# EAGLE design senseBox-MCU_v10 (EAGLE 7.7.0)

## Sheet 1 of 4
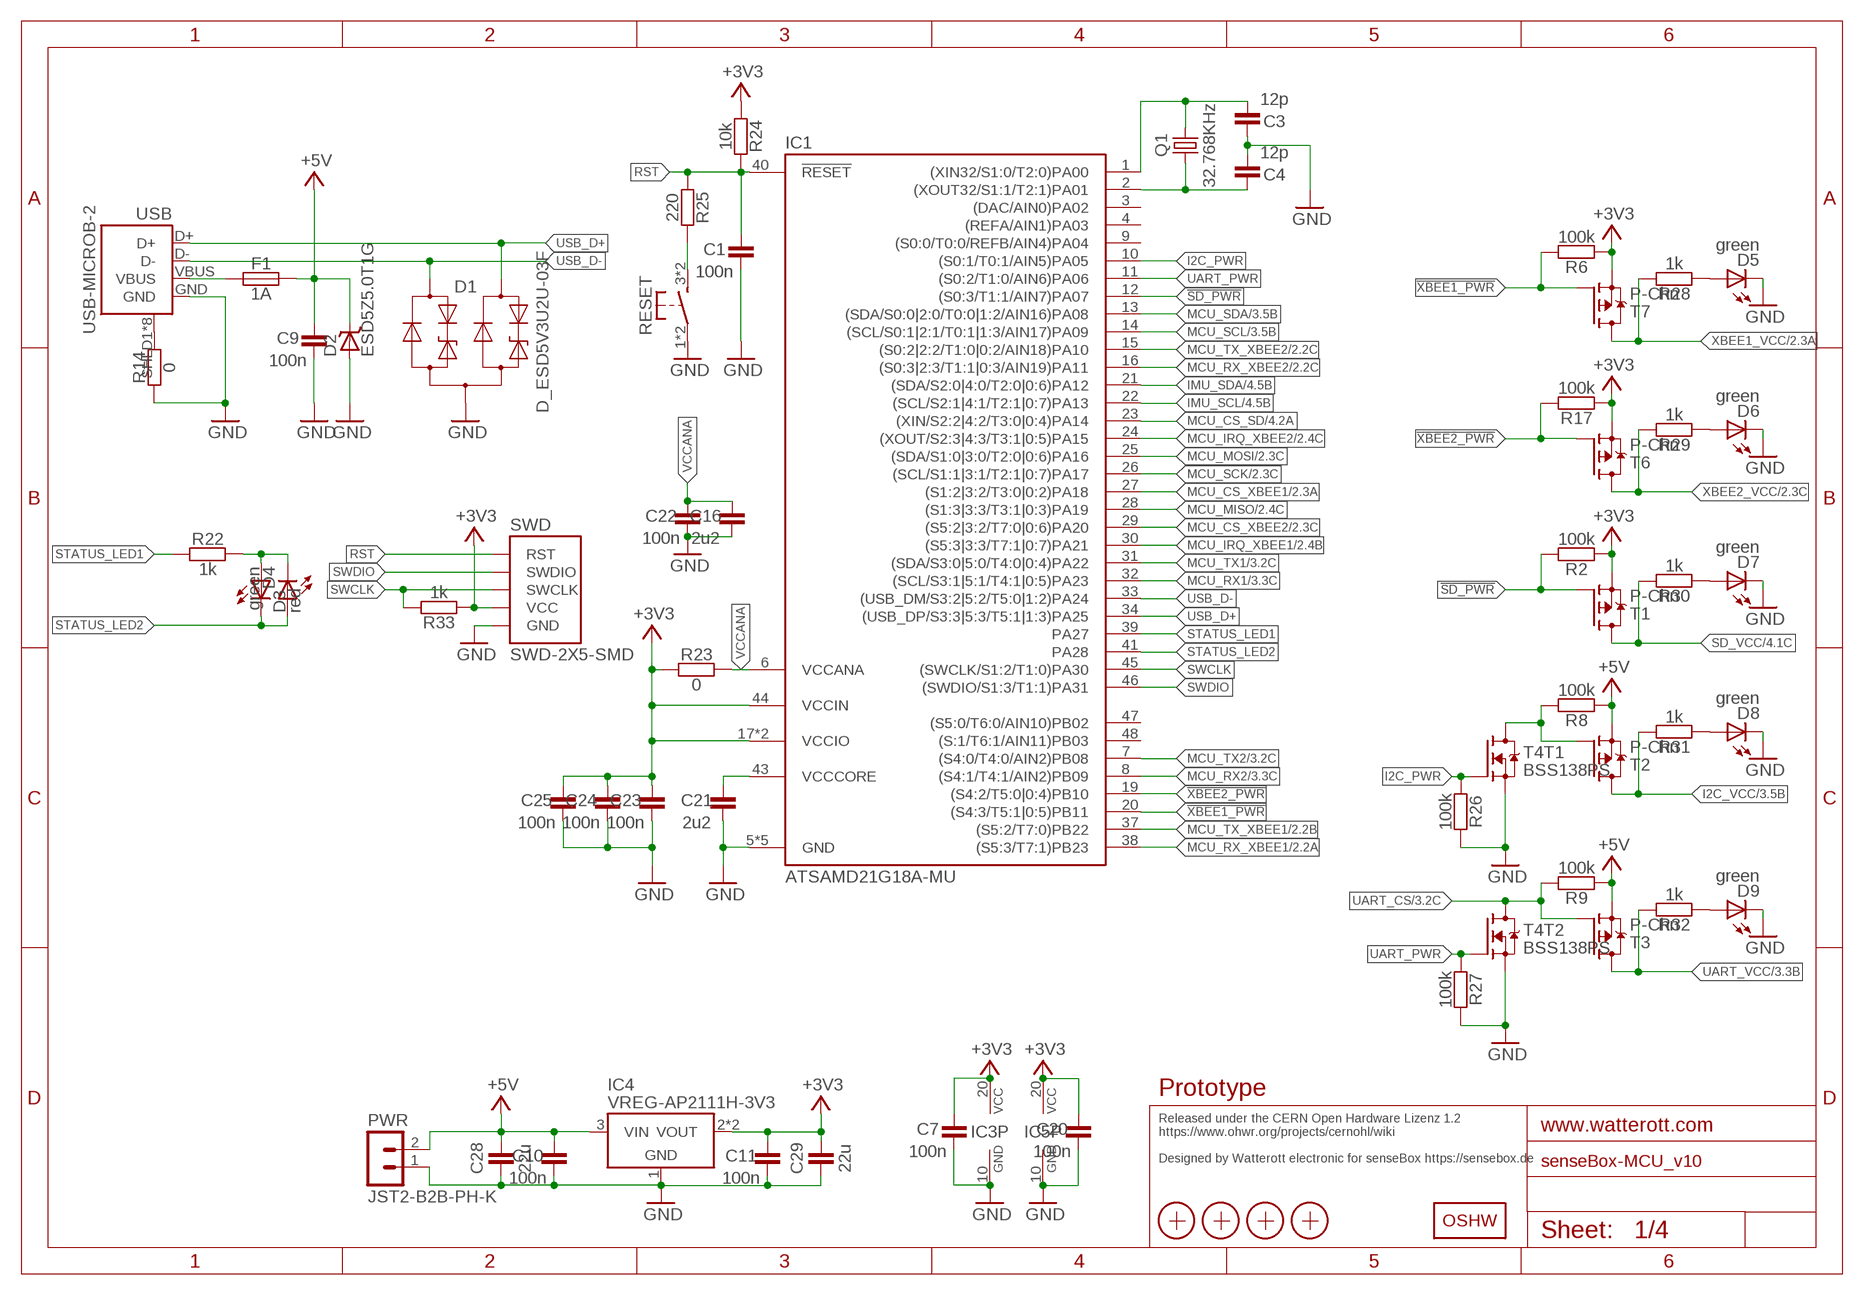
[diagram p0: schematic, sheet 1]

### Parts
C1  100n  CAPACITOR-0402  [C0402]
C3  12p  CAPACITOR-0402  [C0402]
C4  12p  CAPACITOR-0402  [C0402]
C7  100n  CAPACITOR-0402  [C0402]
C9  100n  CAPACITOR-0402  [C0402]
C10  100n  CAPACITOR-0402  [C0402]
C11  100n  CAPACITOR-0402  [C0402]
C16  2u2  CAPACITOR-0402  [C0402]
C20  100n  CAPACITOR-0402  [C0402]
C21  2u2  CAPACITOR-0402  [C0402]
C22  100n  CAPACITOR-0402  [C0402]
C23  100n  CAPACITOR-0402  [C0402]
C24  100n  CAPACITOR-0402  [C0402]
C25  100n  CAPACITOR-0402  [C0402]
C28  22u  CAPACITOR-0805  [C0805]
C29  22u  CAPACITOR-0805  [C0805]
D1  D_ESD5V3U2U-03F  [SOT723]
D2  ESD5Z5.0T1G  D_TVS-SOD523  [SOD523]
D3  red  LED-0603  [C0603]
D4  green  LED-0603  [C0603]
D5  green  LED-0603  [C0603]
D6  green  LED-0603  [C0603]
D7  green  LED-0603  [C0603]
D8  green  LED-0603  [C0603]
D9  green  LED-0603  [C0603]
F1  1A  FUSE-0805  [C0805]
IC1  ATSAMD21G18A-MU  [QFN48-PAD]
IC3  74LVC244PW  [TSSOP20]
IC4  VREG-AP2111H-3V3  VREG-TS1117CW-3V3  [SOT223]
IC5  74LVC244PW  [TSSOP20]
LOGO2  OSHW_LOGOX0070  [OSHW_6X70]
PWR  JST2-B2B-PH-K  [JST_B2B-PH-K]
Q1  32.768KHz  CRYSTAL-ZM315  [CRYSTAL_ZM315]
R2  100k  RESISTOR-0402  [C0402]
R6  100k  RESISTOR-0402  [C0402]
R8  100k  RESISTOR-0402  [C0402]
R9  100k  RESISTOR-0402  [C0402]
R14  0  RESISTOR-0402  [C0402]
R17  100k  RESISTOR-0402  [C0402]
R22  1k  RESISTOR-0402  [C0402]
R23  0  RESISTOR-0402  [C0402]
R24  10k  RESISTOR-0402  [C0402]
R25  220  RESISTOR-0402  [C0402]
R26  100k  RESISTOR-0402  [C0402]
R27  100k  RESISTOR-0402  [C0402]
R28  1k  RESISTOR-0402  [C0402]
R29  1k  RESISTOR-0402  [C0402]
R30  1k  RESISTOR-0402  [C0402]
R31  1k  RESISTOR-0402  [C0402]
R32  1k  RESISTOR-0402  [C0402]
R33  1k  RESISTOR-0402  [C0402]
RESET  SW-TACTILE-PTS840P  [PTS840P]
SWD  SWD-2X5-SMD  [SWD-2X5_SMD]
T1  P-Chn  MOSFET-P-SOT23  [SOT23]
T2  P-Chn  MOSFET-P-SOT23  [SOT23]
T3  P-Chn  MOSFET-P-SOT23  [SOT23]
T4  BSS138PS  [SOT363]
T6  P-Chn  MOSFET-P-SOT23  [SOT23]
T7  P-Chn  MOSFET-P-SOT23  [SOT23]
USB  USB-MICROB-2  [USB-MICROB-10118194]
X1  PASSER-07  [PASSER_07MM]
X2  PASSER-07  [PASSER_07MM]
X3  PASSER-07  [PASSER_07MM]
X4  PASSER-07  [PASSER_07MM]

### Nets
!I2C_POWER: R8.2 T2.1(G) T4.6(T1:D)
!SD_PWR: IC1.12((S0:3/T1:1/AIN7)PA07) R2.2 T1.1(G)
!XBEE1_PWR: IC1.20((S4:3/T5:1|0:5)PB11) R6.2 T7.1(G)
!XBEE2_PWR: IC1.19((S4:2/T5:0|0:4)PB10) R17.2 T6.1(G)
+3V3: C7.2 C11.2 C20.2 C23.2 C24.2 C25.2 C29.2 IC1.17(VCCIO) IC1.36(VCCIO) IC1.44(VCCIN) IC3.20(P:VCC) IC4.2(VOUT) IC4.4(VOUT) IC5.20(P:VCC) R2.1 R6.1 R17.1 R23.1 R24.1 R33.1 SWD.VCC T1.2(S) T6.2(S) T7.2(S) ; also sheet 3,4
+5V: C9.2 C10.2 C28.2 D2.C F1.2 IC4.3(VIN) PWR.2 R8.1 R9.1 T2.2(S) T3.2(S)
GND: C1.1 C3.2 C4.1 C7.1 C9.1 C10.1 C11.1 C16.1 C20.1 C21.1 C22.1 C23.1 C24.1 C25.1 C28.1 C29.1 D1.3(A) D2.A D5.C D6.C D7.C D8.C D9.C IC1.5(GND) IC1.18(GND) IC1.35(GND) IC1.42(GND) IC1.TP(GND) IC3.10(P:GND) IC4.1(GND) IC5.10(P:GND) PWR.1 R14.1 R26.2 R27.2 RESET.1 RESET.2(P1) SWD.GND@1(GND) SWD.GND@2(GND) SWD.GND@3(GND) T4.1(T1:S) T4.4(T2:S) USB.GND ; also sheet 2,3,4
I2C_PWR: IC1.10((S0:1/T0:1/AIN5)PA05) R26.1 T4.2(T1:G)
I2C_VCC: R31.2 T2.3(D) ; also sheet 3
IMU_SCL: IC1.22((SCL/S2:1|4:1/T2:1|0:7)PA13) ; also sheet 4
IMU_SDA: IC1.21((SDA/S2:0|4:0/T2:0|0:6)PA12) ; also sheet 4
MCU_CS_SD: IC1.23((XIN/S2:2|4:2/T3:0|0:4)PA14) ; also sheet 4
MCU_CS_XBEE1: IC1.27((S1:2|3:2/T3:0|0:2)PA18) ; also sheet 2
MCU_CS_XBEE2: IC1.29((S5:2|3:2/T7:0|0:6)PA20) ; also sheet 2
MCU_IRQ_XBEE1: IC1.30((S5:3|3:3/T7:1|0:7)PA21) ; also sheet 2
MCU_IRQ_XBEE2: IC1.24((XOUT/S2:3|4:3/T3:1|0:5)PA15) ; also sheet 2
MCU_MISO: IC1.28((S1:3|3:3/T3:1|0:3)PA19) ; also sheet 2,4
MCU_MOSI: IC1.25((SDA/S1:0|3:0/T2:0|0:6)PA16) ; also sheet 2,4
MCU_RX1: IC1.32((SCL/S3:1|5:1/T4:1|0:5)PA23) ; also sheet 3
MCU_RX2: IC1.8((S4:1/T4:1/AIN2)PB09) ; also sheet 3
MCU_RX_XBEE1: IC1.38((S5:3/T7:1)PB23) ; also sheet 2
MCU_RX_XBEE2: IC1.16((S0:3|2:3/T1:1|0:3/AIN19)PA11) ; also sheet 2
MCU_SCK: IC1.26((SCL/S1:1|3:1/T2:1|0:7)PA17) ; also sheet 2,4
MCU_SCL: IC1.14((SCL/S0:1|2:1/T0:1|1:3/AIN17)PA09) ; also sheet 3
MCU_SDA: IC1.13((SDA/S0:0|2:0/T0:0|1:2/AIN16)PA08) ; also sheet 3
MCU_TX1: IC1.31((SDA/S3:0|5:0/T4:0|0:4)PA22) ; also sheet 3
MCU_TX2: IC1.7((S4:0/T4:0/AIN2)PB08) ; also sheet 3
MCU_TX_XBEE1: IC1.37((S5:2/T7:0)PB22) ; also sheet 2
MCU_TX_XBEE2: IC1.15((S0:2|2:2/T1:0|0:2/AIN18)PA10) ; also sheet 2
N$1: C3.1 IC1.1((XIN32/S1:0/T2:0)PA00) Q1.2
N$2: C4.2 IC1.2((XOUT32/S1:1/T2:1)PA01) Q1.1
N$5: D5.A R28.1
N$6: D6.A R29.1
N$7: D7.A R30.1
N$8: D8.A R31.1
N$9: D9.A R32.1
N$12: D3.A D4.C R22.2
N$13: R25.2 RESET.3(S1) RESET.4(S1)
RST: C1.2 IC1.40(!RESET) R24.2 R25.1 SWD.RST
SD_VCC: R30.2 T1.3(D) ; also sheet 4
SHLD: R14.2 USB.SHLD1(SHIELD) USB.SHLD2(SHIELD) USB.SHLD3(SHIELD) USB.SHLD4(SHIELD) USB.SHLD5(SHIELD) USB.SHLD6(SHIELD) USB.SHLD7(SHIELD) USB.SHLD8(SHIELD)
STATUS_LED1: IC1.39(PA27) R22.1
STATUS_LED2: D3.C D4.A IC1.41(PA28)
SWCLK: IC1.45((SWCLK/S1:2/T1:0)PA30) R33.2 SWD.SWCLK
SWDIO: IC1.46((SWDIO/S1:3/T1:1)PA31) SWD.SWDIO
UART_CS: R9.2 T3.1(G) T4.3(T2:D) ; also sheet 3
UART_PWR: IC1.11((S0:2/T1:0/AIN6)PA06) R27.1 T4.5(T2:G)
UART_VCC: R32.2 T3.3(D) ; also sheet 3
USB_D+: D1.2(C2) IC1.34((USB_DP/S3:3|5:3/T5:1|1:3)PA25) USB.D+
USB_D-: D1.1(C1) IC1.33((USB_DM/S3:2|5:2/T5:0|1:2)PA24) USB.D-
VBUS: F1.1 USB.VBUS
VCCANA: C16.2 C22.2 IC1.6(VCCANA) R23.2
VCCCORE: C21.2 IC1.43(VCCCORE)
XBEE1_VCC: R28.2 T7.3(D) ; also sheet 2
XBEE2_VCC: R29.2 T6.3(D) ; also sheet 2
Unconnected: IC1.3((DAC/AIN0)PA02) IC1.4((REFA/AIN1)PA03) IC1.9((S0:0/T0:0/REFB/AIN4)PA04) IC1.47((S5:0/T6:0/AIN10)PB02) IC1.48((S:1/T6:1/AIN11)PB03)

### Notes on the sheet
- Prototype
- Released under the CERN Open Hardware Lizenz 1.2
  https://www.ohwr.org/projects/cernohl/wiki
  
  Designed by Watterott electronic for senseBox https://sensebox.de

## Sheet 2 of 4
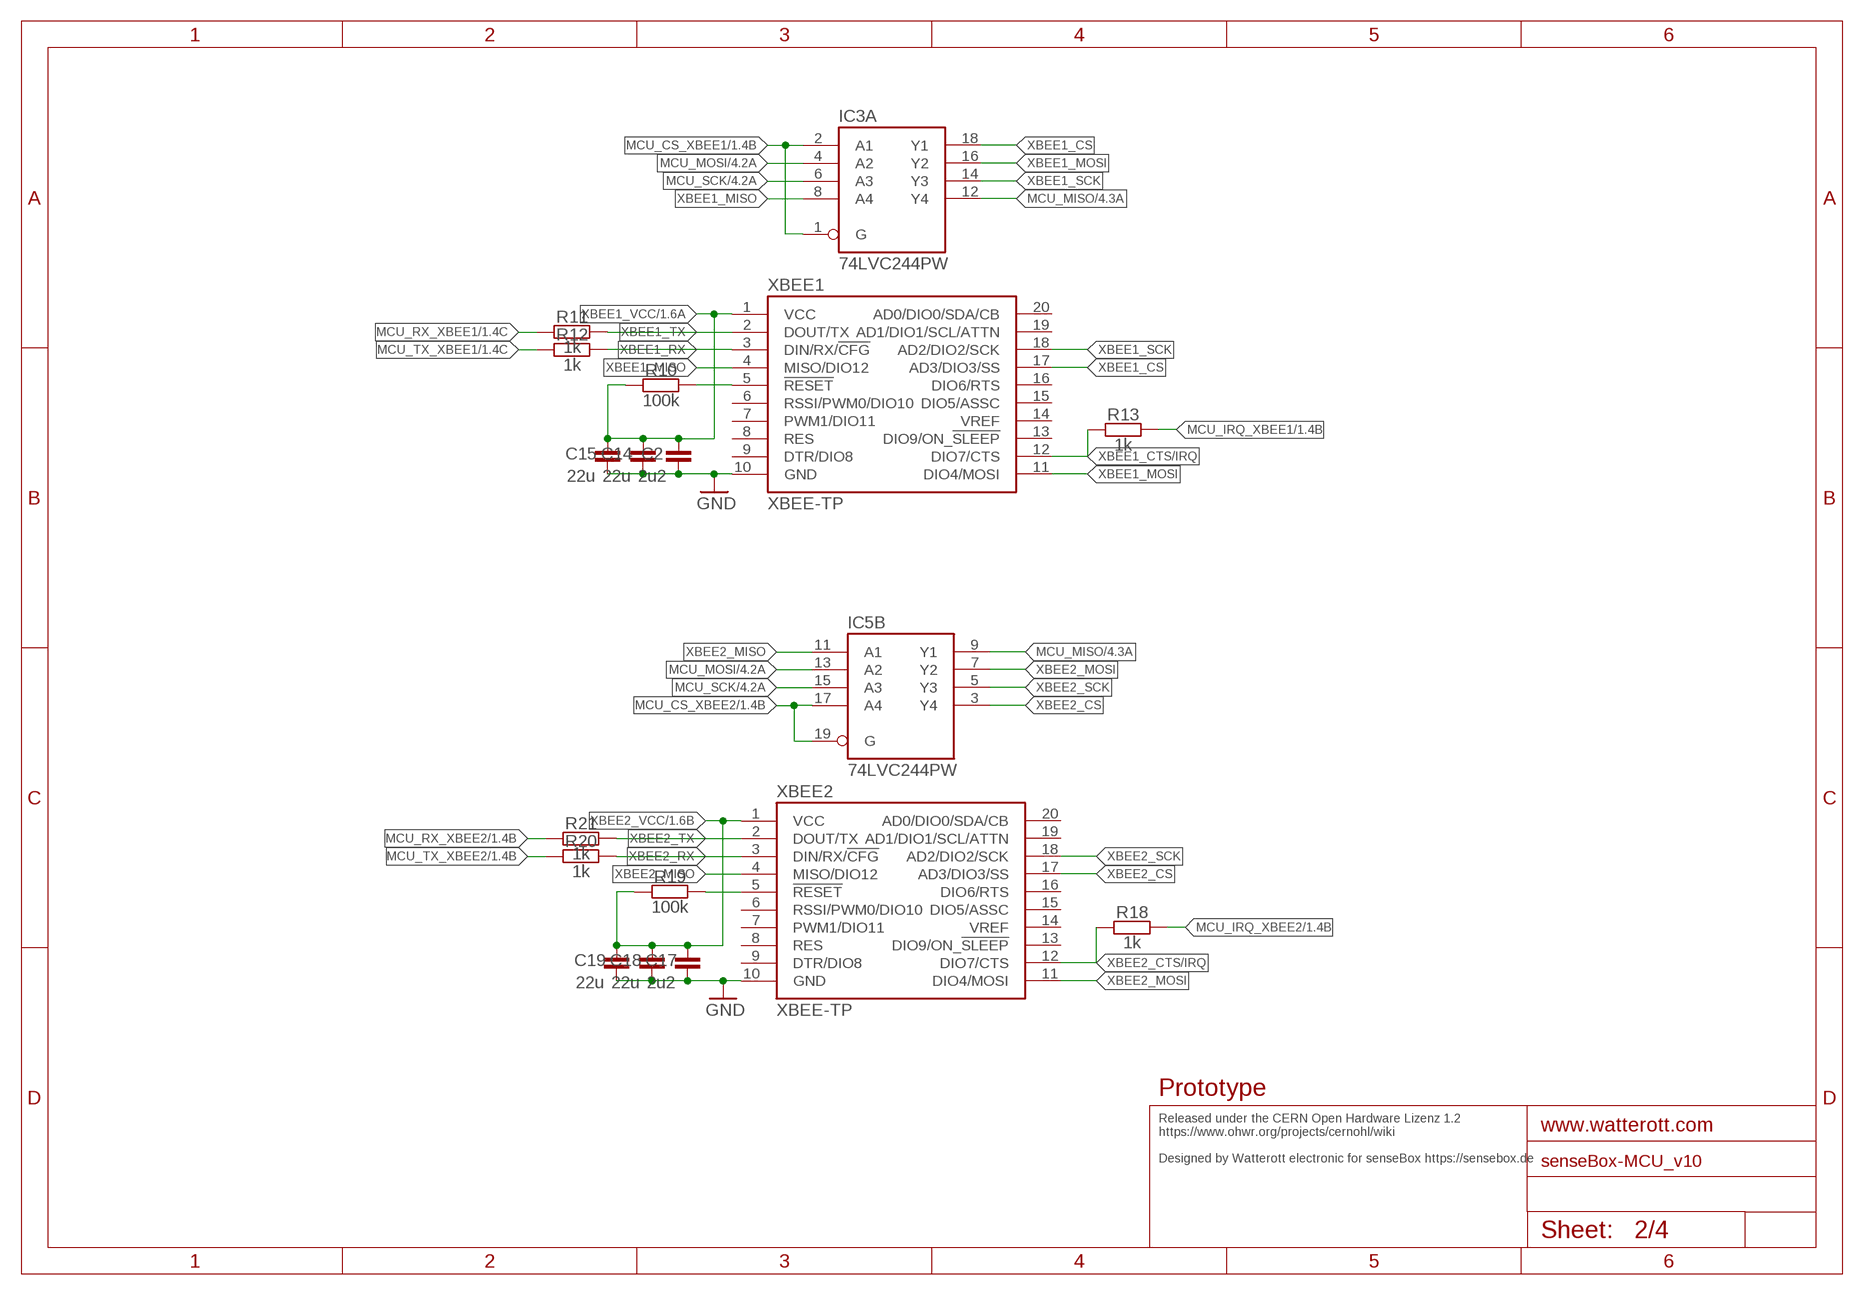
[diagram p1: schematic, sheet 2]

### Parts
C2  2u2  CAPACITOR-0402  [C0402]
C14  22u  CAPACITOR-0805  [C0805]
C15  22u  CAPACITOR-0805  [C0805]
C17  2u2  CAPACITOR-0402  [C0402]
C18  22u  CAPACITOR-0805  [C0805]
C19  22u  CAPACITOR-0805  [C0805]
R10  100k  RESISTOR-0402  [C0402]
R11  1k  RESISTOR-0402  [C0402]
R12  1k  RESISTOR-0402  [C0402]
R13  1k  RESISTOR-0402  [C0402]
R18  1k  RESISTOR-0402  [C0402]
R19  100k  RESISTOR-0402  [C0402]
R20  1k  RESISTOR-0402  [C0402]
R21  1k  RESISTOR-0402  [C0402]
XBEE1  XBEE-TP  [XBEE_TP]
XBEE2  XBEE-TP  [XBEE_TP]

### Nets
GND: C2.1 C14.1 C15.1 C17.1 C18.1 C19.1 XBEE1.10(GND) XBEE2.10(GND) ; also sheet 1,3,4
MCU_CS_XBEE1: IC3.1(A:G) IC3.2(A:A1) ; also sheet 1
MCU_CS_XBEE2: IC5.17(B:A4) IC5.19(B:G) ; also sheet 1
MCU_IRQ_XBEE1: R13.2 ; also sheet 1
MCU_IRQ_XBEE2: R18.2 ; also sheet 1
MCU_MISO: IC3.12(A:Y4) IC5.9(B:Y1) ; also sheet 1,4
MCU_MOSI: IC3.4(A:A2) IC5.13(B:A2) ; also sheet 1,4
MCU_RX_XBEE1: R11.1 ; also sheet 1
MCU_RX_XBEE2: R21.1 ; also sheet 1
MCU_SCK: IC3.6(A:A3) IC5.15(B:A3) ; also sheet 1,4
MCU_TX_XBEE1: R12.1 ; also sheet 1
MCU_TX_XBEE2: R20.1 ; also sheet 1
N$3: R19.2 XBEE2.5(!RESET!)
N$4: R10.2 XBEE1.5(!RESET!)
XBEE1_CS: IC3.18(A:Y1) XBEE1.17(AD3/DIO3/SS)
XBEE1_CTS/IRQ: R13.1 XBEE1.12(DIO7/CTS)
XBEE1_MISO: IC3.8(A:A4) XBEE1.4(MISO/DIO12)
XBEE1_MOSI: IC3.16(A:Y2) XBEE1.11(DIO4/MOSI)
XBEE1_RX: R12.2 XBEE1.3(DIN/RX/!CFG!)
XBEE1_SCK: IC3.14(A:Y3) XBEE1.18(AD2/DIO2/SCK)
XBEE1_TX: R11.2 XBEE1.2(DOUT/TX)
XBEE1_VCC: C2.2 C14.2 C15.2 R10.1 XBEE1.1(VCC) ; also sheet 1
XBEE2_CS: IC5.3(B:Y4) XBEE2.17(AD3/DIO3/SS)
XBEE2_CTS/IRQ: R18.1 XBEE2.12(DIO7/CTS)
XBEE2_MISO: IC5.11(B:A1) XBEE2.4(MISO/DIO12)
XBEE2_MOSI: IC5.7(B:Y2) XBEE2.11(DIO4/MOSI)
XBEE2_RX: R20.2 XBEE2.3(DIN/RX/!CFG!)
XBEE2_SCK: IC5.5(B:Y3) XBEE2.18(AD2/DIO2/SCK)
XBEE2_TX: R21.2 XBEE2.2(DOUT/TX)
XBEE2_VCC: C17.2 C18.2 C19.2 R19.1 XBEE2.1(VCC) ; also sheet 1
Unconnected: XBEE1.6(RSSI/PWM0/DIO10) XBEE1.7(PWM1/DIO11) XBEE1.8(RES) XBEE1.9(DTR/DIO8) XBEE1.13(DIO9/ON_!SLEEP!) XBEE1.14(VREF) XBEE1.15(DIO5/ASSC) XBEE1.16(DIO6/RTS) XBEE1.19(AD1/DIO1/SCL/ATTN) XBEE1.20(AD0/DIO0/SDA/CB) XBEE2.6(RSSI/PWM0/DIO10) XBEE2.7(PWM1/DIO11) XBEE2.8(RES) XBEE2.9(DTR/DIO8) XBEE2.13(DIO9/ON_!SLEEP!) XBEE2.14(VREF) XBEE2.15(DIO5/ASSC) XBEE2.16(DIO6/RTS) XBEE2.19(AD1/DIO1/SCL/ATTN) XBEE2.20(AD0/DIO0/SDA/CB)

### Notes on the sheet
- Prototype
- Released under the CERN Open Hardware Lizenz 1.2
  https://www.ohwr.org/projects/cernohl/wiki
  
  Designed by Watterott electronic for senseBox https://sensebox.de

## Sheet 3 of 4
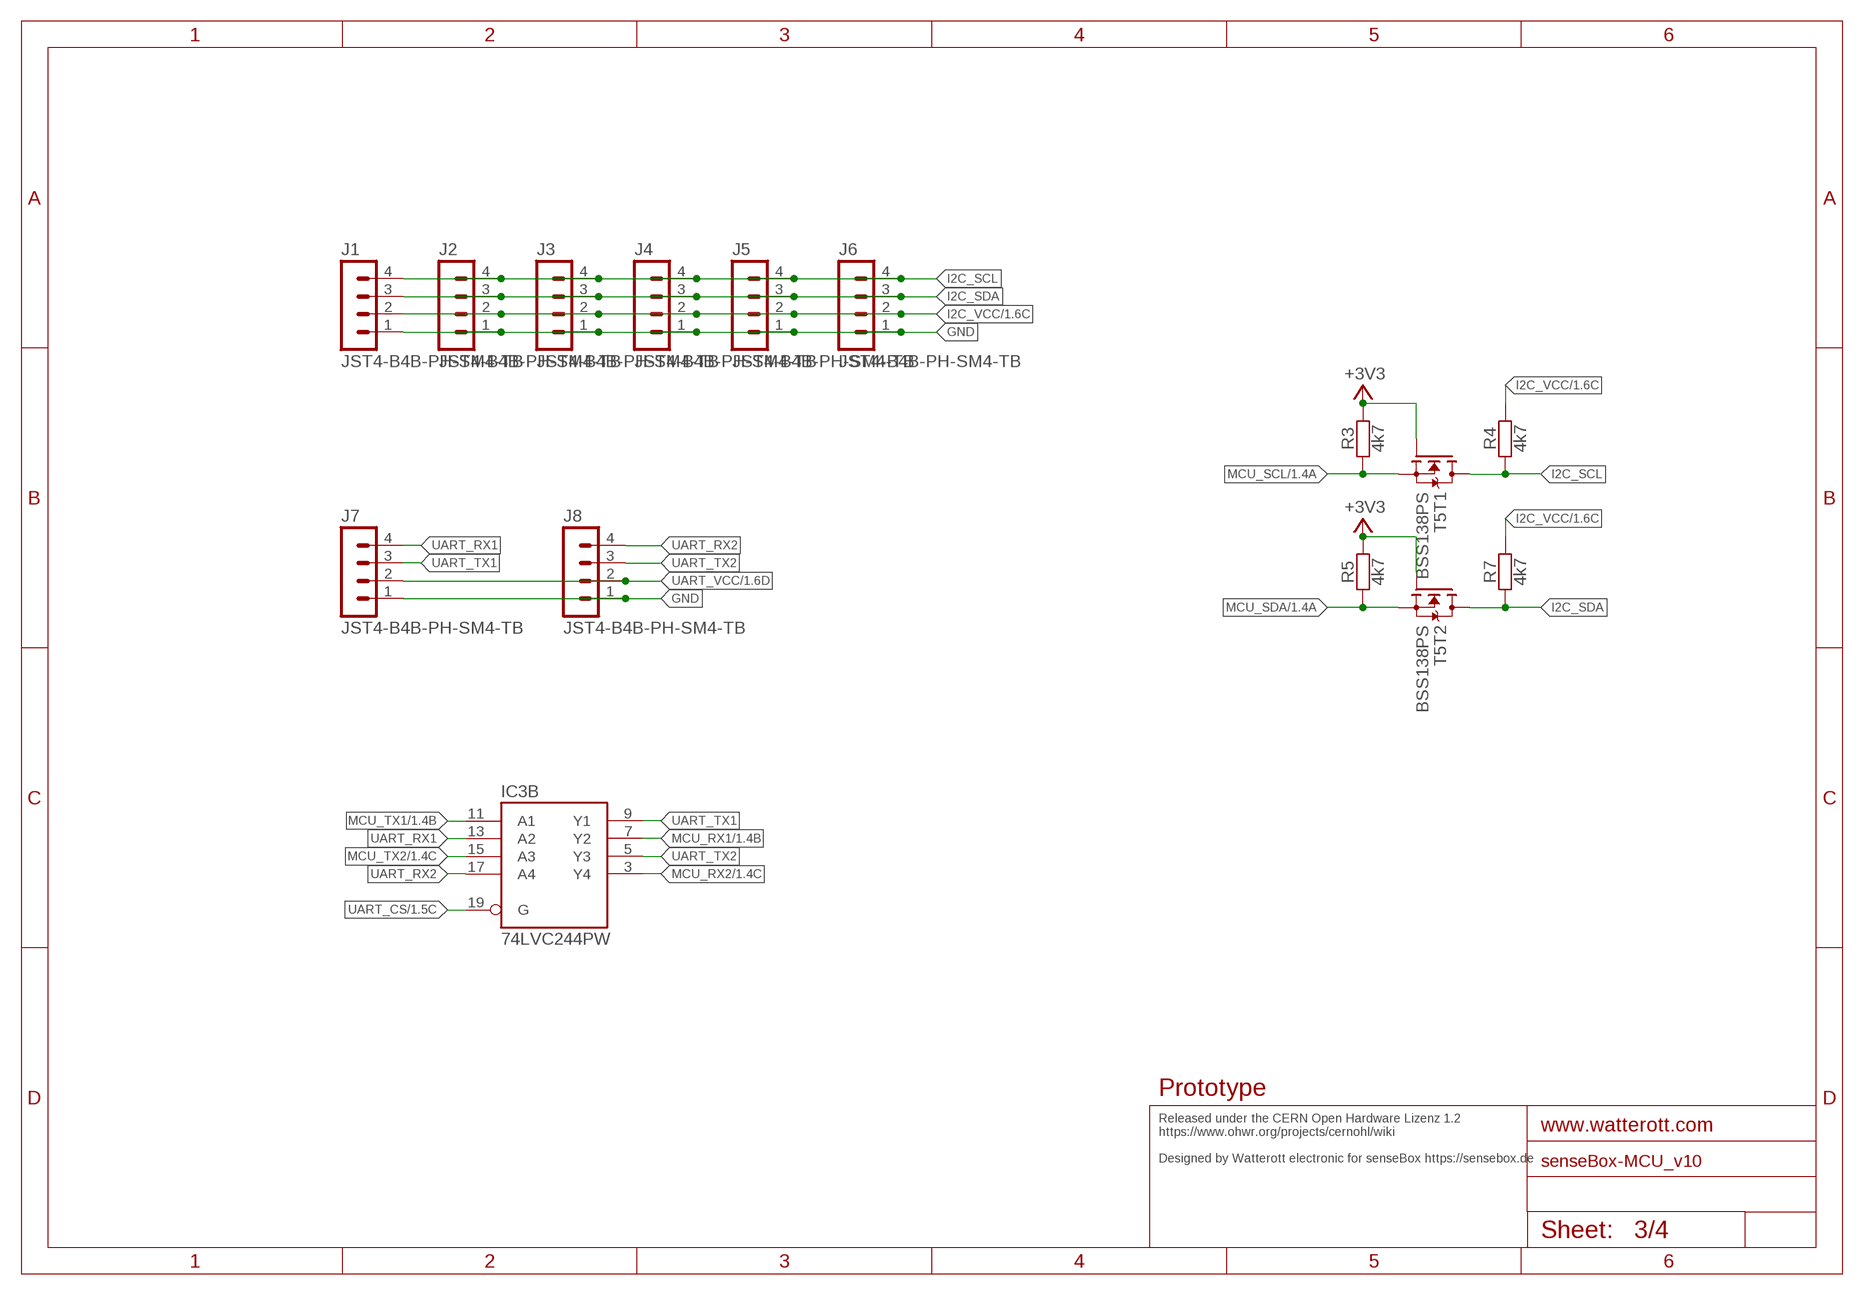
[diagram p2: schematic, sheet 3]

### Parts
J1  JST4-B4B-PH-SM4-TB  [JST_B4B-PH-SM4-TB]
J2  JST4-B4B-PH-SM4-TB  [JST_B4B-PH-SM4-TB]
J3  JST4-B4B-PH-SM4-TB  [JST_B4B-PH-SM4-TB]
J4  JST4-B4B-PH-SM4-TB  [JST_B4B-PH-SM4-TB]
J5  JST4-B4B-PH-SM4-TB  [JST_B4B-PH-SM4-TB]
J6  JST4-B4B-PH-SM4-TB  [JST_B4B-PH-SM4-TB]
J7  JST4-B4B-PH-SM4-TB  [JST_B4B-PH-SM4-TB]
J8  JST4-B4B-PH-SM4-TB  [JST_B4B-PH-SM4-TB]
R3  4k7  RESISTOR-0402  [C0402]
R4  4k7  RESISTOR-0402  [C0402]
R5  4k7  RESISTOR-0402  [C0402]
R7  4k7  RESISTOR-0402  [C0402]
T5  BSS138PS  [SOT363]

### Nets
+3V3: R3.2 R5.2 T5.2(T1:G) T5.5(T2:G) ; also sheet 1,4
GND: J1.1 J2.1 J3.1 J4.1 J5.1 J6.1 J7.1 J8.1 ; also sheet 1,2,4
I2C_SCL: J1.4 J2.4 J3.4 J4.4 J5.4 J6.4 R4.1 T5.6(T1:D)
I2C_SDA: J1.3 J2.3 J3.3 J4.3 J5.3 J6.3 R7.1 T5.3(T2:D)
I2C_VCC: J1.2 J2.2 J3.2 J4.2 J5.2 J6.2 R4.2 R7.2 ; also sheet 1
MCU_RX1: IC3.7(B:Y2) ; also sheet 1
MCU_RX2: IC3.3(B:Y4) ; also sheet 1
MCU_SCL: R3.1 T5.1(T1:S) ; also sheet 1
MCU_SDA: R5.1 T5.4(T2:S) ; also sheet 1
MCU_TX1: IC3.11(B:A1) ; also sheet 1
MCU_TX2: IC3.15(B:A3) ; also sheet 1
UART_CS: IC3.19(B:G) ; also sheet 1
UART_RX1: IC3.13(B:A2) J7.4
UART_RX2: IC3.17(B:A4) J8.4
UART_TX1: IC3.9(B:Y1) J7.3
UART_TX2: IC3.5(B:Y3) J8.3
UART_VCC: J7.2 J8.2 ; also sheet 1

### Notes on the sheet
- Prototype
- Released under the CERN Open Hardware Lizenz 1.2
  https://www.ohwr.org/projects/cernohl/wiki
  
  Designed by Watterott electronic for senseBox https://sensebox.de

## Sheet 4 of 4
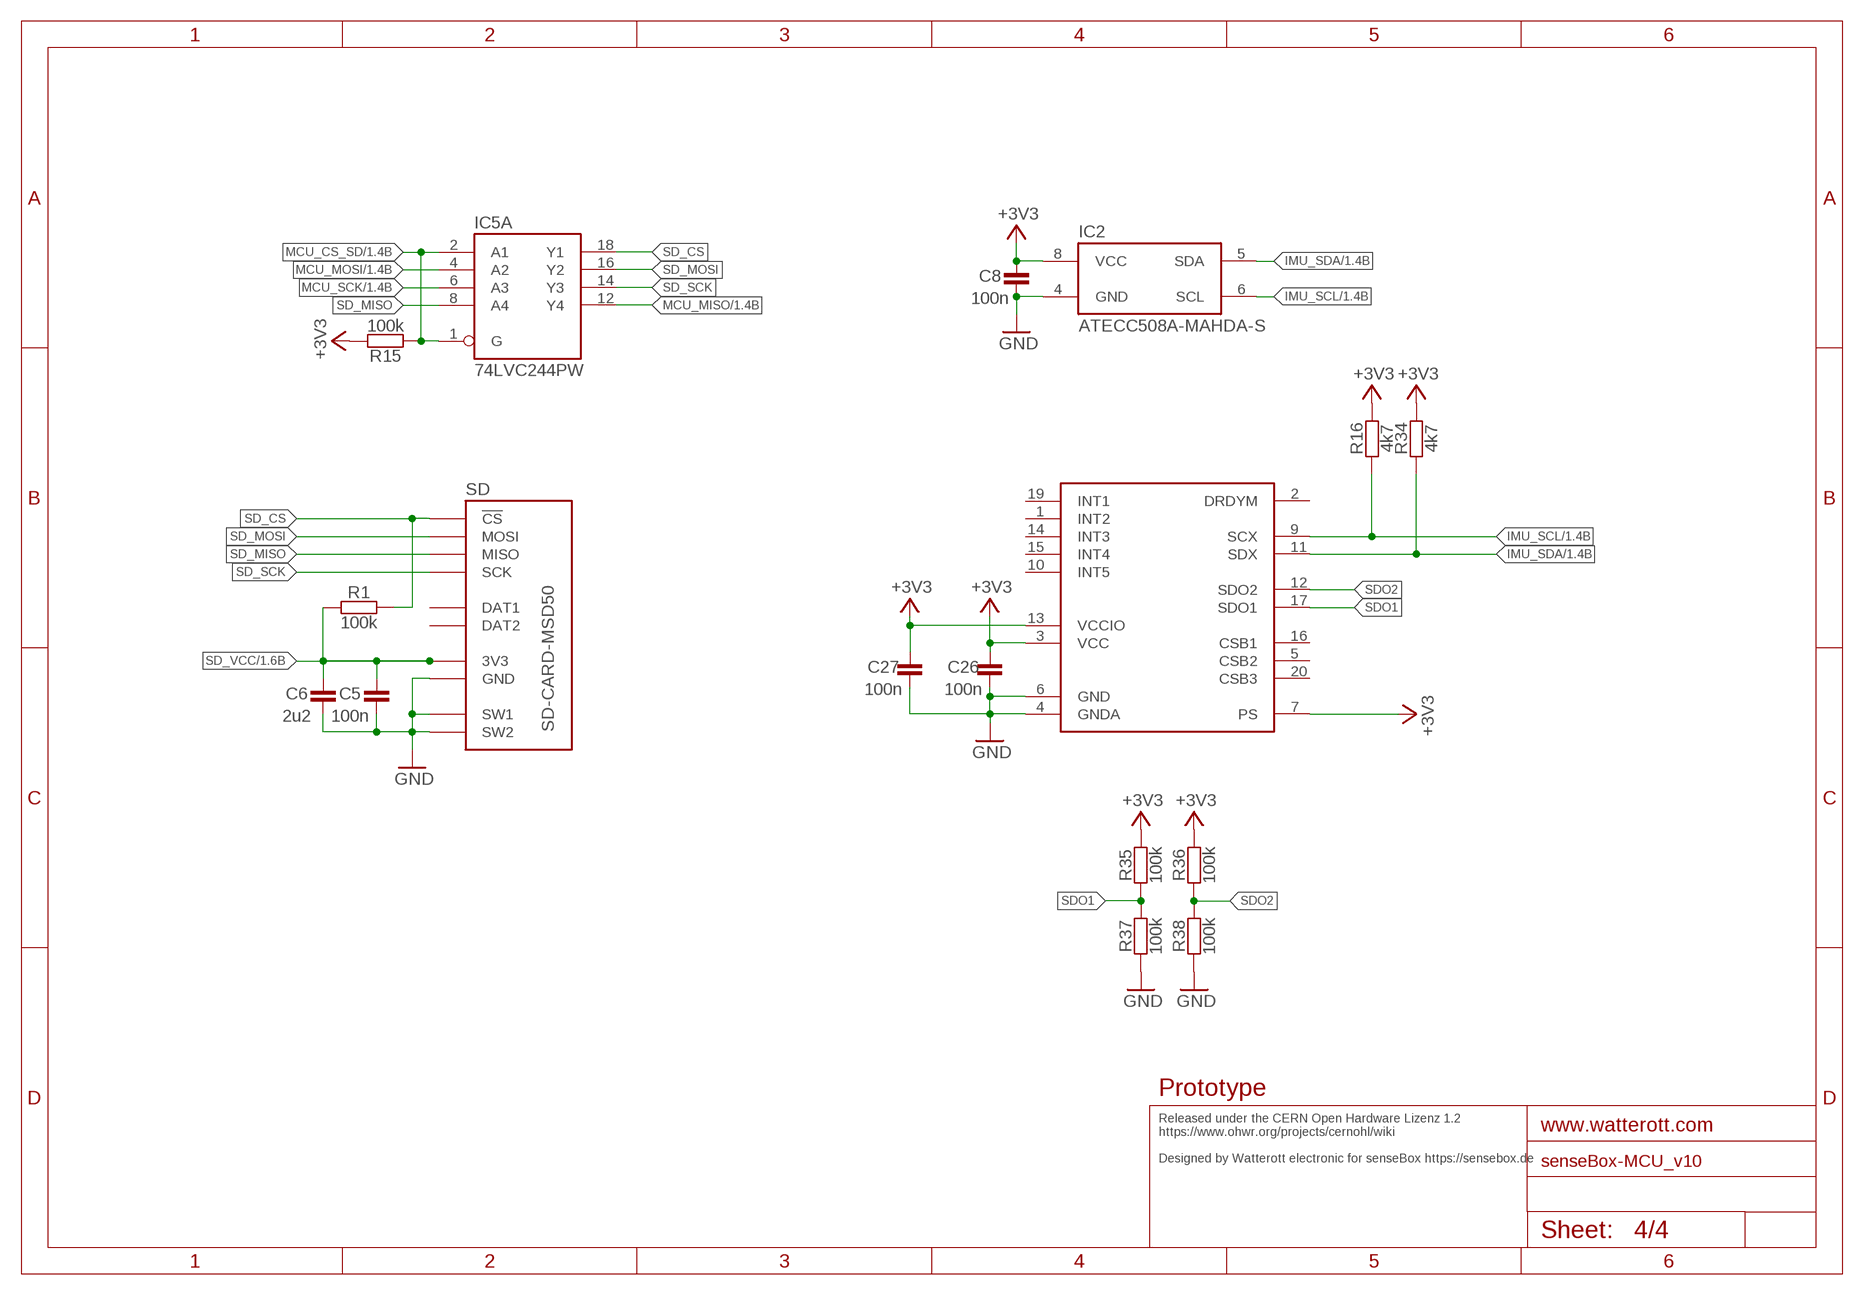
[diagram p3: schematic, sheet 4]

### Parts
C5  100n  CAPACITOR-0402  [C0402]
C6  2u2  CAPACITOR-0402  [C0402]
C8  100n  CAPACITOR-0402  [C0402]
C26  100n  CAPACITOR-0402  [C0402]
C27  100n  CAPACITOR-0402  [C0402]
IC2  ATECC508A-MAHDA-S  [UDFN8]
R1  100k  RESISTOR-0402  [C0402]
R15  100k  RESISTOR-0402  [C0402]
R16  4k7  RESISTOR-0402  [C0402]
R34  4k7  RESISTOR-0402  [C0402]
R35  100k  RESISTOR-0402  [C0402]
R36  100k  RESISTOR-0402  [C0402]
R37  100k  RESISTOR-0402  [C0402]
R38  100k  RESISTOR-0402  [C0402]
SD  SD-CARD-MSD50  [SD_5031821853]
U1  BMX055  [BMX055]

### Nets
+3V3: C8.2 C26.2 C27.2 IC2.8(VCC) R15.2 R16.2 R34.2 R35.2 R36.2 U1.3(VCC) U1.7(PS) U1.13(VCCIO) ; also sheet 1,3
GND: C5.1 C6.1 C8.1 C26.1 C27.1 IC2.4(GND) R37.1 R38.1 SD.GND SD.SW1 SD.SW2 U1.4(GNDA) U1.6(GND) ; also sheet 1,2,3
IMU_SCL: IC2.6(SCL) R16.1 U1.9(SCX) ; also sheet 1
IMU_SDA: IC2.5(SDA) R34.1 U1.11(SDX) ; also sheet 1
MCU_CS_SD: IC5.1(A:G) IC5.2(A:A1) R15.1 ; also sheet 1
MCU_MISO: IC5.12(A:Y4) ; also sheet 1,2
MCU_MOSI: IC5.4(A:A2) ; also sheet 1,2
MCU_SCK: IC5.6(A:A3) ; also sheet 1,2
SD_CS: IC5.18(A:Y1) R1.2 SD.CS(!CS)
SD_MISO: IC5.8(A:A4) SD.MISO
SD_MOSI: IC5.16(A:Y2) SD.MOSI
SD_SCK: IC5.14(A:Y3) SD.SCK
SD_VCC: C5.2 C6.2 R1.1 SD.VCC(3V3) ; also sheet 1
SDO1: R35.1 R37.2 U1.17(SDO1)
SDO2: R36.1 R38.2 U1.12(SDO2)
Unconnected: SD.DAT1 SD.DAT2 U1.1(INT2) U1.2(DRDYM) U1.5(CSB2) U1.10(INT5) U1.14(INT3) U1.15(INT4) U1.16(CSB1) U1.19(INT1) U1.20(CSB3)

### Notes on the sheet
- Prototype
- Released under the CERN Open Hardware Lizenz 1.2
  https://www.ohwr.org/projects/cernohl/wiki
  
  Designed by Watterott electronic for senseBox https://sensebox.de

## Library data of the parts
C1-C11 C14-C29 = we-rcl:CAPACITOR: Capacitors ...2.2uF @ 6.3V -> 0402 ...4.7uF @ 6.3V -> 0603 ...10uF @ 16V -> 0805 ...22uF @ 25V -> 1206
D1 = we-rcl:D_ESD5V3U2U: TVS Diode - Uni-directional Ultra Low ESD / Transient Protection Diode Vrwm=5.3V, 0.4pF@1MHz; DIGIKEY: ESD5V3U2U-03F H6327DKR-ND
D2 = we-rcl:D_TVS: TVS Diodes (Transient Voltage Suppressor Diodes)
D3-D9 = we-opto:LED: LEDs red, green, blue -> 0603
F1 = we-rcl:FUSE: Fuses Polyfuses 0805 - 0.5A or 1A, 6V 1206 - 2A, 6V 1812 - 1A or 2A, 16V
IC1 = we-chip:ATSAMD21G: Atmel ATSAMD21Gxx ARM Cortex-M0+ ATSAMD21G18 - 256kb Flash 32kb RAM ATSAMD21G17 - 128kb Flash 16kb RAM ATSAMD21G16 - 64kb Flash 8kb RAM ATSAMD21G15 - 32kb Flash 4kb RAM
IC2 = we-chip:ATECC508A: Atmel ATECC508A Crypto-Authentication Device
IC3 IC5 = we-chip:74*244: 74x244 Octal Buffer and Line Driver (3-State); DIGIKEY: 568-1583-2-ND
IC4 = we-power:VREG: Voltage Regulators (LDOs, Switching Converters...) LDOs Taiwan Semi TS1117 800mA max 15V - compatible On Semi NCP1117 1A max 20V - compatible Diodes AP2111H 0.6A max 6V (0.25V@0.6A) - compatible Diodes AP2114H 1A max 6V (0.45V@1A) Taiwan Semi TS9011 250mA max 12V - compatible Diodes AP2210 300mA max 15V - compatible Microchip MCP1700 250mA max 6.5V - compatible Microchip MCP1702 250mA max 13V - compatible Microchip MCP1703 250mA max 16V - compatible Microchip MCP1754 150mA max 16V Taiwan Semi TS5204 150mA max 16V (low noise) DC/DC Converter Modules Recom R-78Ex.x-1.0-W36 1A max 28V - compatible CUI V78xx-2000 2A max 18V Murata OKI-78SR-x.x/1.5-W36 1.5A max 36V
J1-J8 = we-con:JST4: JST Connector
LOGO2 = we-symbol:OSHW_LOGO: Open-Source-Hardware Logo
PWR = we-con:JST2: JST Connector
Q1 = we-rcl:CRYSTAL: Crystals
R1-R38 = we-rcl:RESISTOR: Resistors all kinds in 0402 and 0603
RESET = we-switch:SW-TACTILE: Tactile Switches; DIGIKEY: CKN10511DKR-ND
SD = we-con:SD-CARD: SD-Card Sockets; DIGIKEY: WM9750TR-ND
SWD = we-board:SWD: ARM Cortex SWD connector
T1-T3 T6 T7 = we-transistor:MOSFET-P: P-Channel MOSFET SOT23 P-Chn MOSFET TSM3401, IRLML6402 (Vds>=20V, Id>=2A + Rds<=0.1Ohm @ Vgs=4.5V)
T4 T5 = we-transistor:BSS138PS: Dual N-Channel MOSFET BSS138 (Vgs>=+/-20V, Vds>=40V, Id>=0.2A + Rds<=3Ohm @ Vgs=4.5V)
U1 = we-sensor:BMX055
USB = we-con:USB: USB Connectors; DIGIKEY: 609-4618-6-ND
X1-X4 = we-symbol:PASSER: Fiducial Markers
XBEE1 XBEE2 = we-board:XBEE: XBEE connector

## Board
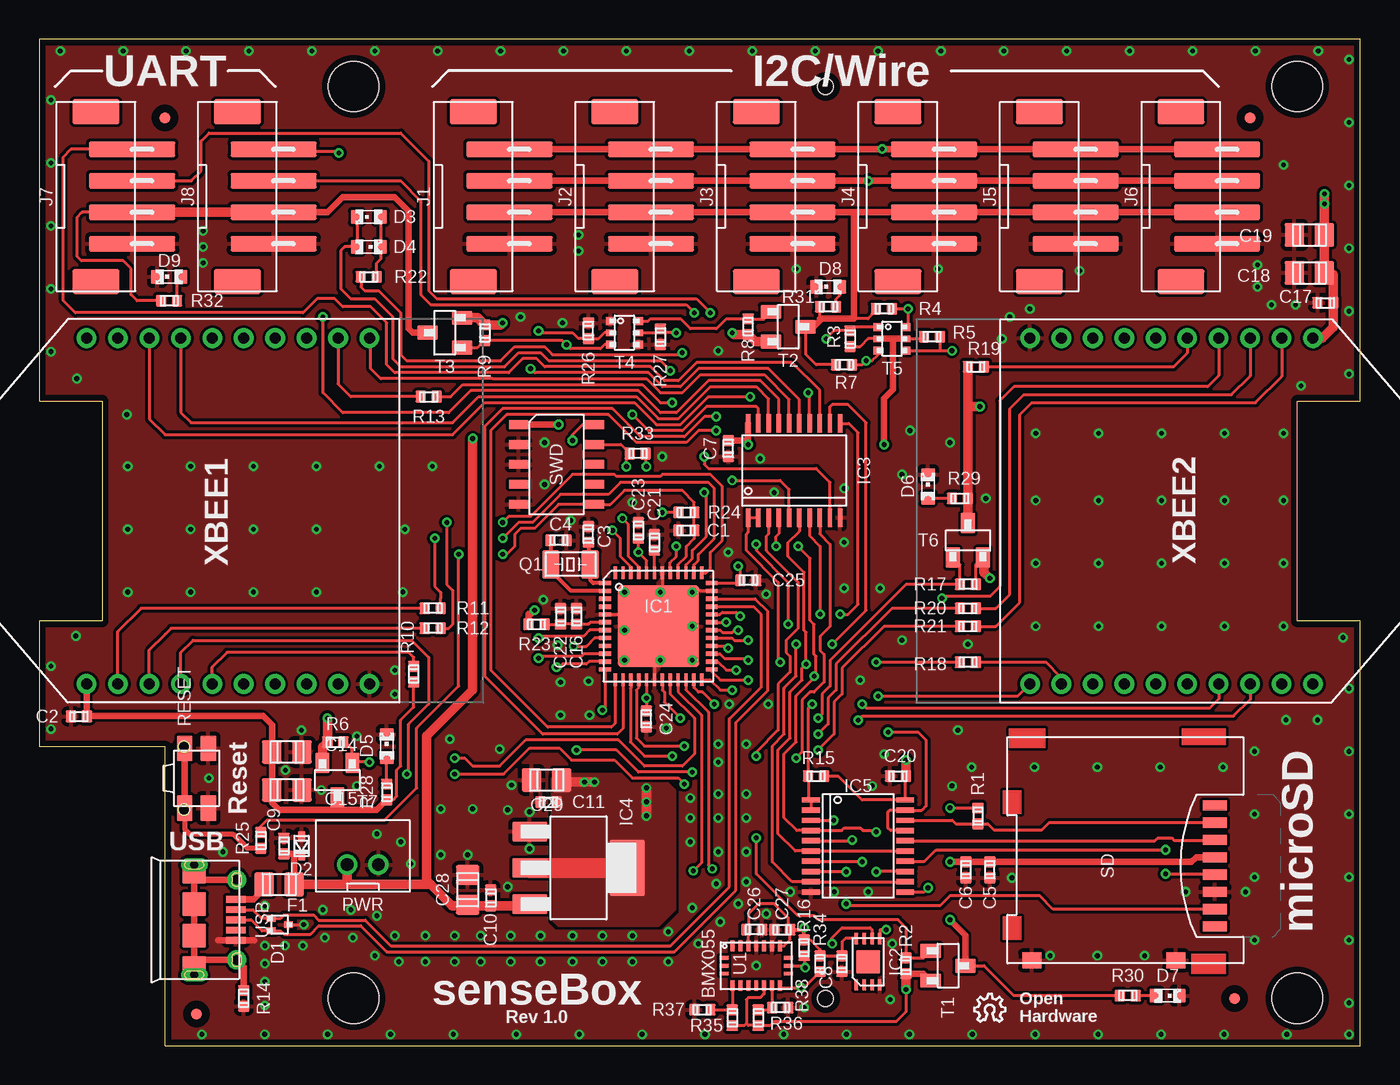
[diagram p4: board, top side]
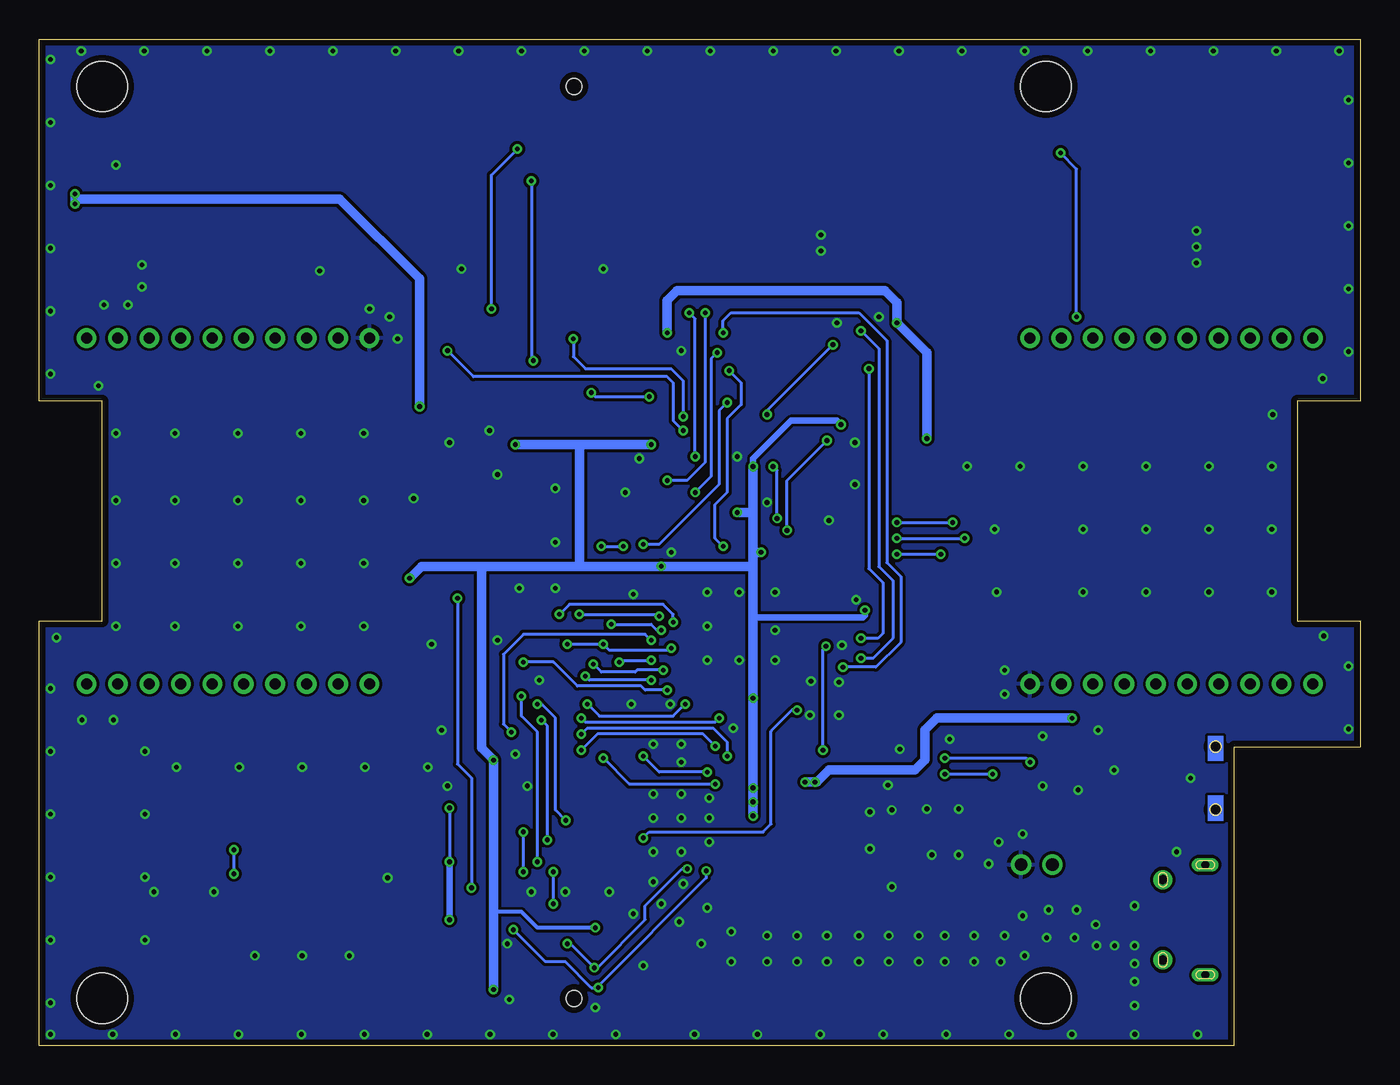
[diagram p5: board, bottom side, seen from below]

Size 84 x 64 mm. Coordinates in mm from the lower left corner, seen from the top.
Outline: 8,0 84,0 84,27 80,27 80,41 84,41 84,64 0,64 0,41 4,41 4,27 0,27 0,19 8,19 8,0
Copper layers (1*16): Top 0.035mm / dielectric 1.5mm / Bottom 0.035mm
Design rules "we-dru-2-layer *": minimum track width 0.2mm, minimum drill 0.3mm, track to track 0.15mm, track to pad 0.15mm, pad to pad 0.15mm, via to via 0.15mm, smd to smd 0.1mm, copper to edge 0.4mm, drill to drill 0.2mm, minimum pad ring 0.18mm, minimum via ring 0.15mm, stop-mask expansion 0.1mm, vias tented up to drill 0.5mm, thermal gap 0.25mm
Holes 3.2 mm at 20,3 80,3 20,61 80,61
Holes 1 mm at 50,3 50,61

### Footprints (pad centres in the part's own frame; a part is rotated, then mirrored left to right if it is on the bottom)
C0402 = smd 0.75 x 0.7: 1 0,0.5; 2 0,-0.5
C0805 = smd 1.5 x 1.25: 1 0,0.95; 2 0,-0.95
SOT723 = smd 0.6 x 0.4: 1 -0.55,0.4; 2 -0.55,-0.4; 3 0.55,0
SOD523 = smd 0.5 x 0.7: A 0,-0.6; C 0,0.6
C0603 = smd 0.9 x 0.8: A 0,-0.75; C 0,0.75
QFN48-PAD = smd 0.8 x 0.26: 1 -3.4,2.75; 2 -3.4,2.25; 3 -3.4,1.75; 4 -3.4,1.25; 5 -3.4,0.75; 6 -3.4,0.25; 7 -3.4,-0.25; 8 -3.4,-0.75; 9 -3.4,-1.25; 10 -3.4,-1.75; 11 -3.4,-2.25; 12 -3.4,-2.75; 25 3.4,-2.75; 26 3.4,-2.25; 27 3.4,-1.75; 28 3.4,-1.25; 29 3.4,-0.75; 30 3.4,-0.25; 31 3.4,0.25; 32 3.4,0.75; 33 3.4,1.25; 34 3.4,1.75; 35 3.4,2.25; 36 3.4,2.75 | smd 0.26 x 0.8: 13 -2.75,-3.4; 14 -2.25,-3.4; 15 -1.75,-3.4; 16 -1.25,-3.4; 17 -0.75,-3.4; 18 -0.25,-3.4; 19 0.25,-3.4; 20 0.75,-3.4; 21 1.25,-3.4; 22 1.75,-3.4; 23 2.25,-3.4; 24 2.75,-3.4; 37 2.75,3.4; 38 2.25,3.4; 39 1.75,3.4; 40 1.25,3.4; 41 0.75,3.4; 42 0.25,3.4; 43 -0.25,3.4; 44 -0.75,3.4; 45 -1.25,3.4; 46 -1.75,3.4; 47 -2.25,3.4; 48 -2.75,3.4 | smd 5.2 x 5.2: TP 0,0
UDFN8 = smd 0.7 x 0.28: 1 -1.475,0.75; 2 -1.475,0.25; 3 -1.475,-0.25; 4 -1.475,-0.75; 5 1.475,-0.75; 6 1.475,-0.25; 7 1.475,0.25; 8 1.475,0.75 | smd 1.5 x 1.5: TP 0,0
TSSOP20 = smd 1.2 x 0.35: 1 -3,2.925; 2 -3,2.275; 3 -3,1.625; 4 -3,0.975; 5 -3,0.325; 6 -3,-0.325; 7 -3,-0.975; 8 -3,-1.625; 9 -3,-2.275; 10 -3,-2.925; 11 3,-2.925; 12 3,-2.275; 13 3,-1.625; 14 3,-0.975; 15 3,-0.325; 16 3,0.325; 17 3,0.975; 18 3,1.625; 19 3,2.275; 20 3,2.925
SOT223 = smd 2.235 x 1.219: 1 -3.099,2.311; 2 -3.099,0; 3 -3.099,-2.311 | smd 2.2 x 3.6: 4 3.099,0
JST_B4B-PH-SM4-TB = smd 5.5 x 1: 1 -2.9,3; 2 -2.9,1; 3 -2.9,-1; 4 -2.9,-3 | smd 3 x 1.6: SHLD1 -0.6,5.4; SHLD2 -0.6,-5.4
JST_B2B-PH-K = drill 0.8 pad 1.3: 1 0,1; 2 0,-1
CRYSTAL_ZM315 = smd 1.8 x 1.1: 1 0,1.25; 2 0,-1.25
PTS840P = smd 1.65 x 1: 1 -1.9,0.75; 2 1.9,0.75; 3 -1.9,-0.75; 4 1.9,-0.75 | hole 0.7: -2,-0.8; 2,-0.8
SD_5031821853 = smd 0.65 x 1.6: CS 2.75,0.8; DAT1 -3.85,0.8; DAT2 3.85,0.8; GND -1.65,0.8; MISO -2.75,0.8; MOSI 1.65,0.8; SCK -0.55,0.8; VCC 0.55,0.8 | smd 1 x 1.2: SW1 -6,12.45; SW2 -6,3.3
SWD-2X5_SMD = smd 1.27 x 0.533: GND@1 -2.413,1.27; GND@2 -2.413,0; GND@3 -2.413,-2.54; NC@1 -2.413,-1.27; NC@2 2.413,-1.27; RST 2.413,-2.54; SWCLK 2.413,1.27; SWDIO 2.413,2.54; SWO 2.413,0; VCC -2.413,2.54
SOT23 = smd 1.3 x 0.9: 1 -1.1,0.95; 2 -1.1,-0.95; 3 1.1,0
SOT363 = smd 0.6 x 0.5: 1 -0.9,0.75; 3 -0.9,-0.75; 4 0.9,-0.75; 6 0.9,0.75 | smd 0.6 x 0.4: 2 -0.9,0; 5 0.9,0
BMX055 = smd 0.25 x 0.675: 1 -1.5,1.262; 2 -1,1.262; 3 -0.5,1.262; 4 0,1.262; 5 0.5,1.262; 6 1,1.262; 7 1.5,1.262; 11 1.5,-1.262; 12 1,-1.262; 13 0.5,-1.262; 14 0,-1.262; 15 -0.5,-1.262; 16 -1,-1.262; 17 -1.5,-1.262 | smd 0.55 x 0.25: 8 2.05,0.5; 9 2.05,0; 10 2.05,-0.5; 18 -2.05,-0.5; 19 -2.05,0; 20 -2.05,0.5
USB-MICROB-10118194 = smd 1.3 x 0.4: D+ -2.5,0; D- -2.5,-0.65; GND -2.5,1.3; ID -2.5,0.65; VBUS -2.5,-1.3 | drill 0.6 pad 1.2: SHLD1 -2.55,2.55; SHLD2 -2.55,-2.55 | drill 0.5 pad 0.8 long: SHLD3 0.15,3.5; SHLD4 0.15,-3.5 | smd 1.5 x 1.1: SHLD5 0.15,2.85; SHLD6 0.15,-2.85 | smd 1.5 x 1.5: SHLD7 0.15,1; SHLD8 0.15,-1
PASSER_07MM = smd 0.7 x 0.7: X 0,0
XBEE_TP = drill 0.7 pad 1.25: 1 -11,9; 2 -11,7; 3 -11,5; 4 -11,3; 5 -11,1; 6 -11,-1; 7 -11,-3; 8 -11,-5; 9 -11,-7; 10 -11,-9; 11 11,-9; 12 11,-7; 13 11,-5; 14 11,-3; 15 11,-1; 16 11,1; 17 11,3; 18 11,5; 19 11,7; 20 11,9

### Placement (x,y rotation side)
C1  41.15,32.77 90 top
C2  2.52,20.93 90 top
C3  34.92,32.51 180 top
C4  33.02,32.13 270 top
C5  60.45,11.18 180 top
C6  58.93,11.18 180 top
C7  43.81,37.97 180 top
C8  51.05,5.21 180 top
C9  15.56,12.7 0 top
C10  28.7,9.4 0 top
C11  32.38,15.49 90 top
C14  15.75,18.67 270 top
C15  15.75,16.26 270 top
C16  34.16,27.3 0 top
C17  81.79,47.24 90 top
C18  80.77,49.15 90 top
C19  80.77,51.56 90 top
C20  54.61,17.14 90 top
C21  39.12,32 0 top
C22  33.15,27.3 0 top
C23  38.1,32.77 0 top
C24  38.61,20.78 180 top
C25  45.09,29.59 270 top
C26  45.47,7.37 270 top
C27  47.24,7.37 90 top
C28  27.24,9.91 0 top
C29  32.26,16.89 90 top
D1  15.29,7.7 0 top
D2  16.68,12.7 180 top
D3  20.95,52.7 90 top
D4  20.95,50.8 270 top
D5  22.1,19.05 0 top
D6  56.52,35.56 0 top
D7  71.75,3.17 270 top
D8  50.16,48.26 90 top
D9  8.26,48.9 90 top
F1  15.25,10.25 90 top
IC1  39.37,26.67 0 top
IC2  52.7,5.33 90 top
IC3  48.01,36.58 90 top
IC4  34.29,11.3 0 top
IC5  52.07,12.7 0 top
J1  27,54 180 top
J2  36,54 180 top
J3  45,54 180 top
J4  54,54 180 top
J5  63,54 180 top
J6  72,54 180 top
J7  3,54 180 top
J8  12,54 180 top
LOGO2  59.45,1.52 0 top
PWR  20.57,11.51 270 top
Q1  33.78,30.61 90 top
R1  59.69,14.61 0 top
R2  55.12,5.08 180 top
R3  51.56,44.96 0 top
R4  53.72,46.86 270 top
R5  56.77,45.09 270 top
R6  18.83,19.3 90 top
R7  51.18,43.31 270 top
R8  45.09,45.72 180 top
R9  28.32,45.34 0 top
R10  23.81,23.62 180 top
R11  25.02,27.81 270 top
R12  25.02,26.54 270 top
R13  24.77,41.27 90 top
R14  13,3 180 top
R15  49.4,17.14 90 top
R16  48.64,6.22 180 top
R17  59.05,29.34 270 top
R18  59.05,24.38 270 top
R19  59.56,43.18 90 top
R20  59.05,27.81 90 top
R21  59.05,26.67 90 top
R22  20.95,48.9 90 top
R23  31.62,26.8 90 top
R24  41.15,33.91 90 top
R25  14.08,13.05 0 top
R26  34.92,45.47 180 top
R27  39.5,45.09 0 top
R28  22.1,16.13 0 top
R29  58.55,34.8 90 top
R30  69.22,3.17 270 top
R31  50.16,46.99 270 top
R32  8.26,47.37 270 top
R33  38.06,37.65 270 top
R34  49.66,5.21 180 top
R35  44.07,1.78 0 top
R36  45.72,1.78 0 top
R37  42.16,2.29 90 top
R38  47.12,2.41 270 top
RESET  10,17 270 top
SD  75.56,11.43 90 top
SWD  32.89,36.96 0 top
T1  57.78,5.08 0 top
T2  47.62,45.72 0 top
T3  25.78,45.34 180 top
T4  37.21,45.34 0 top
T5  54.23,44.96 0 top
T6  59.05,32.13 90 top
T7  18.95,16.89 270 top
U1  45.59,5.08 0 top
USB  10,8 180 top
X1  10,2 0 top
X2  8,59 0 top
X3  77,59 0 top
X4  76,3 0 top
XBEE1  12,34 90 top
XBEE2  72,34 270 top

### Tracks (layer width: path | path; a pad name or v marks a point on that pad's centre or on a via)
!I2C_POWER
  Top 0.203: T2.1 46.08,46.22 R8.2 43.68,46.22 43.05,45.59 41.4,45.59 40.77,46.23 38.86,46.23 38.72,46.09 T4.6
!SD_PWR  (via drill 0.3 pad 0.61)
  Top 0.2: 49.28,8.26 48.26,8.26 45.59,10.92
  Top 0.203: T1.1 56.23,5.58 R2.2 55.12,7.49 54.61,8 49.53,8 49.28,8.26 | 45.59,10.92 v45.59,13.21 | IC1.12 35.97,21.49 v35.81,21.34
  Bottom 0.203: v45.59,13.21 45.21,13.59 37.97,13.59 37.47,14.1 37.47,20 36.13,21.34 v35.81,21.34
!XBEE1_PWR  (via drill 0.3 pad 0.61)
  Top 0.203: IC1.20 40.12,22.36 41.66,20.83 41.66,18.54 40.89,17.78 38.48,17.78 36.83,19.43 30.92,19.43 29.27,17.78 27.56,17.78 27.05,18.29 v26.42,18.29 | R6.2 19.46,19.3 19.9,18.86 T7.1 19.95,18.03 v20.99,18.03
  Bottom 0.203: v26.42,18.29 21.24,18.29 v20.99,18.03
!XBEE2_PWR  (via drill 0.3 pad 0.61)
  Top 0.203: T6.1 58.55,30.58 R17.2 55.12,29.34 50.29,24.51 50.29,22.86 49.78,22.35 49.78,21.08 v49.53,20.83 | IC1.19 39.62,22.61 39.75,22.48 39.75,21.84 v40.77,20.83
  Bottom 0.203: v49.53,20.83 49.28,20.57 41.02,20.57 v40.77,20.83
+3V3  (via drill 0.3, 0.3 pad 0.61)
  Top 0.203: IC1.17 v38.62,22.11 v38.61,22.1 C24.2 | IC1.44 38.62,30.85 v38.1,31.37 C23.2 | R24.1 v39.62,33.91 | C20.2 55.07,17.11 IC5.20 52.32,15.62 50.8,17.14 R15.2 | R17.1 59.55,30.58 T6.2 | T5.5 56.14,44.96 R5.2 | T5.2 52.7,44.96 52.2,44.46 R3.2 | IC1.36 44.41,29.42 C25.2 44.59,30.34 v44.45,30.48 | R33.1 38.56,36.88 v38.61,36.83 | U1.3 45.09,7.24 C26.2 45.09,7.49 45.09,8.38 45.72,9.02 46.74,9.02 47.62,8.13 47.62,7.49 C27.2 | R35.2 44.83,1.28 44.96,1.41 | U1.13 46.09,3.29 45.85,3.05 45.09,3.05 44.96,2.92 44.96,1.41 | C27.2 48,7.37 | R16.2 49.03,6.72 49.66,6.1 R34.2 C8.2 51.05,6.6 51.26,6.81 IC2.8 | U1.7 47.36,6.34 47.75,6.73 47.75,7.36 C27.2 | 44.96,1.41 45.09,1.28 R36.2 46.48,1.27 46.74,1.52 54.48,1.52 55.12,2.16 v55.12,3.56
  Top 0.254: 48,7.37 48.51,7.37 v48.64,7.49 R16.2
  Top 0.406: R2.1 56.23,4.58 T1.2 | SWD.VCC v33.02,39.5 | R23.1 31.12,27.44 31.25,27.44 v31.5,27.69 | v53.72,38.23 53.72,41.15 54.29,41.72 54.29,44.96 | IC3.20 v45.08,38.23 v45.09,38.23 44.84,38.47 C7.2 | 54.29,44.96 T5.2 | 54.29,44.96 T5.5
  Top 0.61: 36.7,11.31 36.7,11.3 | v38.61,14.61 v38.61,15.49 v38.61,16.38 | T7.2 18,18.98 R6.1 v18.33,20.82 v18.32,20.83 | C20.2 v55.12,18.16 | R2.1 v55.12,3.56 | v60.45,29.72 60.07,30.1 60.07,30.96 T6.2 | v35.31,16.76 33.34,16.76 C29.2
  Top 1.27: IC4.2 36.7,11.3 IC4.4
  Bottom 0.254: v48.64,7.49 52.32,7.49 53.34,8.51 55.12,8.51
  Bottom 0.406: v33.02,39.5 33.27,39.75 36.2,39.75 38.61,37.34 v38.61,36.83 | 38.61,27.24 31.62,27.24 31.5,27.37 v31.5,27.69
  Bottom 0.61: 38.61,30.48 38.61,27.24 v38.61,22.1 v38.61,16.38 v38.61,15.49 v38.61,14.61 | 38.61,30.48 38.61,31.37 | 38.61,31.37 v38.1,31.37 | 38.61,30.48 v44.45,30.48 49.66,30.48 | v55.12,3.56 55.12,8.51 v55.12,18.16 55.88,18.92 55.88,30.48 | 49.66,30.48 55.88,30.48 | 55.88,30.48 59.69,30.48 v60.45,29.72 | v39.62,33.91 38.61,33.91 | 38.61,33.91 38.61,31.37 | v38.61,36.83 38.61,33.91 | v45.09,38.23 49.66,38.23 | 49.66,38.23 v53.72,38.23 | 49.66,38.23 49.66,30.48 | v18.32,20.83 26.92,20.83 27.69,20.07 27.69,18.16 28.32,17.53 33.78,17.53 34.54,16.76 v35.31,16.76
  other vias: 34.67,16.76
  pour Top (no thermals): 32.64,8 32.64,17.02 32.89,17.27 39.37,17.27 40.39,16.26 40.39,8.64 39.37,7.62 33.02,7.62
+5V  (via drill 0.3 pad 0.61)
  Top 0.406: 31.1,8.9 IC4.3 | 19.57,10.27 19.56,10.25 | 24.64,13.72 24.64,13.78 | C9.2 16.13,12.2 | 16.13,12.2 16.58,12.2 D2.C | F1.2 16.2,12.13 16.13,12.2
  Top 0.61: F1.2 19.56,10.25 24.89,10.25 | 31.1,8.9 C10.2 27.3,8.9 C28.2 27.18,8.9 26.24,8.9 24.89,10.25 | PWR.2 19.57,10.27 | v44.07,45.34 44.19,45.22 R8.1 45.53,44.77 T2.2 | T3.2 27.87,46.29 R9.1 29.33,45.84 v29.46,45.97 | 24.89,10.25 24.64,10.5 24.64,13.78 24.64,19.68 27.56,22.61 v27.56,38.61
  Bottom 0.61: v44.07,45.34 44.07,47.37 43.43,48.01 30.23,48.01 29.46,47.24 v29.46,45.97 27.56,44.07 v27.56,38.61
GND  (via drill 0.3 pad 0.61)
  Top 0.203: IC1.42 39.62,28.96 | IC1.35 41.56,28.92 41.53,28.96 39.62,28.96 | IC1.18 39.12,26.67 IC1.TP 39.37,27.42 | IC1.5 39.37,27.42 | 39.62,28.96 39.37,28.96 39.37,27.42 | D1.3 v16.81,7.7
  Top 0.406: 11.38,6.71 13.66,6.71
  other vias: 32.13,35.69 47.75,9.78 50.55,9.78 52.96,16.51 53.72,18.54 34.29,51.56 34.29,50.55 10.41,51.82 10.41,50.8 10.41,49.78 30.04,16.57 25.53,15.05 29.78,14.99 27.56,15.05 27.24,12.13 31.18,14.86 31.18,12.51 29.78,10.1 25.53,12.13 33.15,21.02 34.92,23.18 14.35,6.35 11.68,12.32 14.35,5.21 15.62,6.35 14.35,4.06 14.35,2.54 16.76,6.35 14.35,8.89 39.88,20.19 43.18,18.03 20.19,19.68 44.96,19.18 44.96,14.48 33.27,45.97 30.61,46.35 43.18,44.2 48.13,49.4 55.37,39.12 57.91,38.35 51.18,35.43 43.81,31.37 46.74,35.18 39.62,37.47 45.85,37.34 33.78,33.4 37.21,28.83 37.21,24.51 41.53,24.51 41.53,28.83 41.53,26.67 37.21,26.42 39.5,24.51 39.5,28.83 33.15,23.11 34.99,21.02 43.05,10.29 43.18,12.32 43.18,14.48 43.18,16 41.53,8.76 40.01,7.24 37.72,6.99 35.81,6.99 33.91,6.99 31.88,6.99 29.97,6.99 28.07,6.99 26.42,6.99 24.54,6.99 22.61,6.99 19.81,8.64 18.03,8.64 18.16,6.86 19.94,6.86 21.34,5.71 24.54,5.33 26.42,5.33 28.07,5.33 29.97,5.33 31.88,5.33 33.91,5.33 35.81,5.33 37.72,5.33 40.01,5.33 41.91,6.48 43.31,7.87 44.45,9.02 44.96,10.41 44.96,12.32 44.96,16 21.46,8.26 54.1,2.92 72.9,9.78 76.71,9.78 78.36,47.12 77.47,49.66 77.47,48.26 57.15,49.4 66.17,49.28 79.88,47.12 17.94,16.26 16.67,20.07 15.65,17.53 10.79,17.02 22.61,23.88 22.61,22.35 20.19,16.51 21.46,13.46 23.62,11.56 22.99,12.95 32.06,28.35 43.18,19.18 46.23,28.7 51.18,32 51.18,29.08 53.47,29.08 54.86,25.78 59.05,25.53 52.2,23.24 63.37,34.67 54.86,36.32 58.42,20.07 58.04,16.51 61.85,10.67 46.35,21.72 43.88,21.72 22.86,5.33 32.13,38.35 62.99,46.86 61.21,44.96 61.72,46.35 79.12,56.01 37.72,34.54 45.59,5.08 48.64,2.41 46.23,8.38 29.27,18.86 32.96,25.46 18.34,0.71 22.34,0.71 26.34,0.71 30.34,0.71 34.34,0.71 38.34,0.71 42.34,0.71 47.34,0.71 51.34,0.71 55.34,0.71 59.34,0.71 63.34,0.71 67.33,0.71 71.33,0.71 75.33,0.71 79.33,0.71 83.28,0.71 83.28,2.71 83.28,6.71 83.28,10.71 83.28,14.71 83.28,18.71 83.28,22.71 82.9,25.95 83.28,42.72 83.28,46.72 83.28,50.72 83.28,54.72 83.28,58.72 81.33,63.27 77.33,63.27 83.28,62.72 73.33,63.27 69.33,63.27 65.33,63.27 61.34,63.27 57.34,63.27 53.34,63.27 49.34,63.27 45.34,63.27 41.34,63.27 37.34,63.27 25.34,63.27 33.34,63.27 29.34,63.27 21.34,63.27 17.34,63.27 13.34,63.27 9.34,63.27 5.33,63.27 1.33,63.27 0.73,60.13 0.73,56.13 0.73,52.13 0.73,48.13 0.73,44.13 5.56,40.13 0.73,24.14 0.73,20.14 5.62,36.85 5.62,32.85 5.62,28.85 9.62,36.85 13.62,36.85 17.62,36.85 9.62,28.85 13.62,28.85 17.62,28.85 17.62,32.85 13.62,32.85 9.62,32.85 63.37,30.67 63.37,26.67 67.37,26.67 71.37,26.67 75.37,26.67 79.12,26.67 79.12,30.67 75.37,30.67 71.37,30.67 67.37,30.67 67.37,34.67 71.37,34.67 75.37,34.67 79.12,34.67 79.12,38.94 75.37,38.94 71.37,38.94 67.37,38.94 63.37,38.94 21.62,36.85 25,36.85 23.24,32.85 23.11,28.85 41.4,15.75 41.4,14.48 41.4,12.95 54.23,6.48 52.7,9.78 81.28,20.71 79.28,20.71 77.28,18.71 75.28,17.71 71.28,17.71 67.28,17.71 63.28,17.71 77.28,14.71 77.28,10.71 77.28,6.71 59.28,17.71 70.28,5.71 67.28,5.71 64.28,5.71 26.1,19.49 14.34,0.71 10.34,0.71 2.32,26.05 2.39,42.42 80.24,41.95 60.2,34.8
  pour Top (isolate 0.18, rank 2): 84,0 0,0 0,64 84,64
  pour Bottom (isolate 0.18): 0,0 84,0 84,64 0,64
I2C_PWR  (via drill 0.3 pad 0.61)
  Top 0.203: T4.2 35.94,45.34 35.57,44.97 R26.1 34.28,44.97 33.91,45.34 31.88,45.34 v31.75,45.47 | IC1.10 34.64,24.92 34.48,24.77 31.88,24.77 v31.75,24.64
  Bottom 0.203: v31.75,45.47 30.61,44.32 30.61,30.46 29.72,29.57 29.72,25.91 30.99,24.64 v31.75,24.64
I2C_SCL  (via drill 0.3 pad 0.61)
  Top 0.203: R4.1 v55.24,46.86 55.24,45.82 T5.6 | v53.59,57.02 53.59,56.87 53.72,57
  Top 0.406: J1.4 J2.4 J3.4 53.72,57 J4.4 J5.4 J6.4
  Bottom 0.203: v55.24,46.86 55.24,55.37 v53.59,57.02
I2C_SDA  (via drill 0.3 pad 0.61)
  Top 0.203: R7.1 52.32,43.31 v52.58,43.56 52.96,43.56 53.33,43.93 T5.3 | v52.7,54.99 v52.7,55
  Top 0.406: J1.3 J2.3 J3.3 v52.7,55 J4.3 J5.3 J6.3
  Bottom 0.203: v52.7,54.99 52.7,43.69 v52.58,43.56
I2C_VCC
  Top 0.203: 49.66,46.23 R31.2 | R4.2 53.22,46.74 52.7,46.23 51.82,46.23 | R7.2 49.4,43.31 48.73,43.98 T2.3
  Top 0.406: J1.2 J2.2 J3.2 51.82,53 | J6.2 J5.2 J4.2 51.82,53 | T2.3 49.28,45.72 49.66,46.1 49.66,46.23 51.82,46.23 51.82,53
IMU_SCL  (via drill 0.3, 0.3 pad 0.6)
  Top 0.203: IC1.22 41.12,22.63 42.55,21.21 42.55,11.49 v42.8,11.24 | v50.42,6.48 50.42,6.86 51.05,7.49 52.83,7.49 52.96,7.37 IC2.6 | R16.1 48.7,5.66 v48.7,4.95 48.58,5.08 U1.9
  Bottom 0.203: v42.8,11.24 43.12,11.24 45.47,8.89 45.47,8 48.51,4.95 v48.7,4.95 50.23,6.48 v50.42,6.48
IMU_SDA  (via drill 0.3, 0.3 pad 0.6)
  Top 0.203: IC1.21 40.62,22.5 42.1,21.02 42.1,11.62 v41.59,11.11 | v53.85,7.37 53.47,7.37 53.47,6.82 IC2.5 | U1.11 47.22,3.69 v48.45,3.69 48.64,3.69 R34.1
  Bottom 0.203: v41.59,11.11 41.59,10.67 48.44,3.82 48.45,3.81 v48.45,3.69 48.9,3.69 50.55,5.33 51.82,5.33 v53.85,7.37
MCU_CS_SD  (via drill 0.3 pad 0.61)
  Top 0.203: IC5.2 IC5.1 48.9,15.79 R15.1 48.9,17.15 48.9,21.46 v49.15,21.72 | IC1.23 41.62,22.77 41.91,22.48 42.16,22.48 v42.93,21.72
  Bottom 0.203: v49.15,21.72 48.39,20.95 43.69,20.95 v42.93,21.72
MCU_CS_XBEE1  (via drill 0.3 pad 0.61)
  Top 0.203: IC1.27 43.28,24.92 43.56,24.64 44.96,24.64 v45.09,24.51 | IC3.2 IC3.1 45.08,32.63 44.96,32.51 44.96,31.5 46.99,29.46 46.99,24.51 v47.12,24.38
  Bottom 0.203: v47.12,24.38 46.99,24.51 v45.09,24.51
MCU_CS_XBEE2  (via drill 0.3 pad 0.61)
  Top 0.203: IC5.17 54.14,13.68 53.98,13.84 53.98,14.86 54.09,14.97 IC5.19 56.12,14.97 56.39,15.24 56.39,19.43 55.88,19.94 v53.98,19.94 | IC1.29 44.06,25.92 44.2,25.78 v45.09,25.78
  Bottom 0.203: v45.09,25.78 45.47,26.16 53.21,26.16 54.48,24.89 54.48,20.45 v53.98,19.94
MCU_IRQ_XBEE1  (via drill 0.3 pad 0.61)
  Top 0.203: IC1.30 43.3,26.42 43.43,26.29 44.07,26.29 44.2,26.42 v44.45,26.42 | R13.2 26.16,41.27 26.92,42.04 38.35,42.04 39.5,40.89 v40.26,40.89 | v45.59,31.88 45.59,31.5 47.62,29.46 v47.62,26.8
  Bottom 0.203: v40.26,40.89 40.77,40.39 40.77,35.69 44.58,31.88 v45.59,31.88 | v47.62,26.8 45.09,26.8 44.7,26.42 v44.45,26.42
MCU_IRQ_XBEE2  (via drill 0.3 pad 0.61)
  Top 0.203: IC1.24 42.64,23.27 43.31,22.61 v44.07,22.61 | v53.21,24.38 R18.2
  Bottom 0.203: v44.07,22.61 45.47,22.61 45.72,22.86 49.78,22.86 51.31,24.38 v53.21,24.38
MCU_MISO  (via drill 0.3 pad 0.61)
  Top 0.203: IC5.12 IC5.9 47.87,10.43 46.61,11.68 46.61,19.05 47.37,19.81 47.37,22.73 48.13,23.5 v48.13,25.53 | IC1.28 43.67,25.42 v43.81,25.27 | v50.42,25.53 52.58,27.69 52.58,39.62 51.44,40.77 50.42,40.77 50.28,40.63 IC3.12
  Bottom 0.203: v43.81,25.27 43.94,25.15 47.75,25.15 v48.13,25.53 v50.42,25.53
MCU_MOSI  (via drill 0.3 pad 0.61)
  Top 0.203: IC5.13 53.24,11.07 v53.21,11.05 | v53.21,13.59 53.13,13.68 52.37,13.68 52.2,13.84 51.18,13.84 51.01,13.68 IC5.4 48.17,13.68 47.37,14.48 47.37,18.54 48.13,19.3 48.13,22.23 49.28,23.37 v49.28,23.5 49.4,23.62 49.4,24.77 49.28,24.89 49.28,26.8 49.02,27.05 49.02,30.99 v48.26,31.75 | v45.09,23.24 43.31,23.24 42.77,23.78 IC1.25 | v46.86,31.75 46.86,32.38 47.03,32.55 IC3.4
  Bottom 0.203: v53.21,11.05 v53.21,13.59 | v45.09,23.24 49.02,23.24 v49.28,23.5 | v48.26,31.75 v46.86,31.75
MCU_RX1  (via drill 0.3 pad 0.61)
  Top 0.203: IC1.32 43.3,27.42 43.43,27.56 44.32,27.56 v44.58,27.3 | IC3.7 48.98,32.43 49.66,31.75 v49.66,27.43
  Bottom 0.203: v49.66,27.43 44.7,27.43 v44.58,27.3
MCU_RX2  (via drill 0.3 pad 0.6, 0.3 pad 0.61)
  Top 0.203: IC3.3 46.38,32.54 46.25,32.41 46.25,31.47 48.26,29.46 48.26,26.54 47.5,25.78 47.5,25.02 47.75,24.77 47.75,23.75 46.99,22.99 46.99,20.07 45.59,18.67 v45.59,18.41 | v41.53,17.4 38.1,17.4 36.7,18.8 v34.16,18.8 | IC1.8 35.32,25.92 34.8,25.4 v33.97,25.4
  Bottom 0.2: v34.16,18.8 34.16,25.21 v33.97,25.4
  Bottom 0.203: v41.53,17.4 44.58,17.4 v45.59,18.41
MCU_RX_XBEE1  (via drill 0.3 pad 0.61)
  Top 0.203: IC1.38 41.62,30.57 41.91,30.86 41.91,31.24 42.93,32.26 42.93,35.43 42.55,35.81 36.96,35.81 36.2,35.05 33.15,35.05 31.37,33.27 30.48,33.27 v29.46,32.26 | v25.15,32.26 25.15,29.21 25.53,28.83 25.53,28.45 25.52,28.44 R11.1
  Bottom 0.203: v29.46,32.26 v25.15,32.26
MCU_RX_XBEE2  (via drill 0.3 pad 0.61)
  Top 0.203: IC1.16 38.12,22.75 37.97,22.61 37.97,19.56 38.48,19.05 v41.02,19.05 | R21.1 53.72,26.67 51.05,24 51.05,22.35 50.55,21.84 50.55,19.81 v49.53,18.8
  Bottom 0.203: v41.02,19.05 41.78,19.81 48.51,19.81 48.9,19.43 v49.53,18.8
MCU_SCK  (via drill 0.3 pad 0.61)
  Top 0.203: IC5.15 IC5.6 48.08,12.38 46.99,13.46 46.99,18.8 47.75,19.56 47.75,22.48 48.51,23.24 48.51,24 v48.77,24.26 48.77,26.29 48.64,26.42 48.64,30.1 47.62,31.11 47.62,32 48.33,32.71 IC3.6 | IC1.26 43.14,24.42 43.69,23.88 v44.32,23.88
  Bottom 0.203: v44.32,23.88 45.97,23.88 46.1,23.75 48.26,23.75 v48.77,24.26
MCU_SCL  (via drill 0.3 pad 0.61)
  Top 0.203: T5.1 51.81,45.71 R3.1 50.54,45.46 v50.04,44.96 | v43.05,40.01 42.29,40.01 41.02,38.73 38.23,38.73 36.45,40.51 29.46,40.51 28.32,39.37 28.32,23.5 32,19.81 36.77,19.81 37.12,20.17 IC1.14
  Bottom 0.203: v50.04,44.96 50.04,43.81 49.28,43.05 43.81,43.05 43.05,42.29 v43.05,40.01
MCU_SDA  (via drill 0.3 pad 0.61)
  Top 0.203: T5.4 57.28,44.21 | R5.1 57.27,44.22 57.28,44.21 | v58.04,44.2 57.29,44.2 57.28,44.21 | v43.05,39.12 41.91,39.12 41.15,38.35 37.97,38.35 36.2,40.13 29.72,40.13 28.7,39.12 28.7,23.88 32.32,20.26 36.39,20.26 36.64,20.51 36.62,20.53 IC1.13
  Bottom 0.203: v43.05,39.12 43.69,39.75 43.69,42.16 44.07,42.55 56.39,42.55 v58.04,44.2
MCU_TX1  (via drill 0.3 pad 0.61)
  Top 0.203: IC1.31 v43.68,26.92 v43.69,26.92 | v50.93,27.43 51.44,27.43 52.07,28.07 52.07,38.99 51.48,39.58 IC3.11
  Bottom 0.203: v43.69,26.92 43.69,27.43 44.32,28.07 50.29,28.07 v50.93,27.43
MCU_TX2  (via drill 0.3 pad 0.61)
  Top 0.203: IC3.15 48.33,41.08 46.35,43.05 41.91,43.05 40.77,41.91 39.62,41.91 38.73,42.8 31.5,42.8 v31.24,43.05 | IC1.7 34.99,26.42 34.61,26.04 31.88,26.04 v31.75,25.91
  Bottom 0.203: v31.24,43.05 31.24,30.34 30.35,29.45 30.35,26.23 30.67,25.91 v31.75,25.91
MCU_TX_XBEE1  (via drill 0.3 pad 0.61)
  Top 0.203: IC1.37 42.39,30.07 42.67,30.35 42.67,31.37 43.43,32.13 43.43,35.56 42.67,36.32 39.62,36.32 39.5,36.2 36.7,36.2 36.58,36.32 33.91,36.32 31.24,33.66 29.84,33.66 v29.46,33.27 | v25.91,33.27 25.91,29.34 26.29,28.96 26.29,26.8 26.04,26.54 R12.1
  Bottom 0.203: v29.46,33.27 v25.91,33.27
MCU_TX_XBEE2  (via drill 0.3 pad 0.61)
  Top 0.203: R20.1 54.23,27.81 50.67,24.26 50.67,22.61 50.16,22.1 50.16,20.45 v49.53,19.81 | IC1.15 37.62,22.76 37.59,22.73 37.59,19.3 38.48,18.41 v40.26,18.41
  Bottom 0.203: v49.53,19.81 49.15,20.19 41.15,20.19 40.26,19.3 v40.26,18.41
N$1
  Top 0.254: C3.1 34.92,30.71 Q1.2 35.05,30.59 35.05,29.59 35.22,29.42 IC1.1
N$2
  Top 0.254: IC1.2 33.82,28.92 32.89,29.84 32.89,30.25 Q1.1 32.53,32.12 C4.2
N$3
  Top 0.203: R19.2 72.14,43.18 73,44.04 XBEE2.5
N$4
  Top 0.203: XBEE1.5 11,24.08 11.94,25.02 23.5,25.02 23.81,24.7 R10.2
N$5
  Top 0.203: R28.1 D5.A
N$6
  Top 0.203: D6.A 58.03,34.81 R29.1
N$7
  Top 0.203: D7.A R30.1
N$8
  Top 0.203: R31.1 50.66,47.49 50.91,47.74 D8.A
N$9
  Top 0.203: R32.1 8.76,48.65 D9.A
N$12
  Top 0.203: D3.A D4.C 21.7,50.03 21.45,49.78 R22.2
N$13
  Top 0.305: RESET.4 9.25,13.74 9.52,13.46 12.32,13.46 13.21,12.57 14.06,12.57 R25.2
  Top 0.406: RESET.3 RESET.4
RST  (via drill 0.3 pad 0.61)
  Top 0.2: 14.48,14.35 21.97,14.35 24,16.38 24,20.19
  Top 0.203: IC1.40 40.62,30.59 41.15,31.11 41.15,31.75 41.65,32.25 C1.2 R24.2 41.65,34.55 40.89,35.31 37.21,35.31 36.32,34.42 SWD.RST 33.02,34.42 31.5,32.89 30.61,32.89 30.23,32.51 30.23,31.75 29.72,31.24 v29.46,31.24 | 24,20.19 26.67,22.86 v26.67,31.24 | R25.1 14.08,13.95 14.48,14.35
  Bottom 0.203: v26.67,31.24 v29.46,31.24
SD_CS
  Top 0.203: SD.CS 64.22,14.18 63.75,13.72 60.71,13.72 60.32,14.11 R1.2 59.68,14.1 58.29,14.1 58.06,14.32 IC5.18
SD_MISO  (via drill 0.3 pad 0.61)
  Top 0.203: SD.MISO 64.47,8.68 63.63,9.53 57.91,9.53 57.28,8.89 51.44,8.89 v51.31,9.02 | IC5.8 51.28,11.07 v51.31,11.05
  Bottom 0.203: v51.31,9.02 v51.31,11.05
SD_MOSI
  Top 0.203: SD.MOSI 74.71,13.03 72.19,13.03 72.01,13.21 71.12,13.21 70.94,13.03 IC5.16
SD_SCK  (via drill 0.3 pad 0.61)
  Top 0.203: IC5.14 56.3,11.72 57.02,12.45 v71.63,12.45 | v71.63,10.92 74.72,10.92 SD.SCK
  Bottom 0.203: v71.63,12.45 v71.63,10.92
SD_VCC  (via drill 0.3 pad 0.61)
  Top 0.203: R30.2 61.98,3.17 60.07,5.08 T1.3 | C6.2 | v57.91,15.11 R1.1
  Top 0.406: C6.2 C5.2 73.27,11.68 73.58,11.98 SD.VCC | T1.3 58.88,7.03 v57.91,8 | v57.91,11.68 C6.2
  Bottom 0.203: v57.91,15.11 v57.91,11.68
  Bottom 0.406: v57.91,8 v57.91,11.68
SDO1
  Top 0.203: U1.17 44.09,2.3 R35.1 R37.2
SDO2
  Top 0.203: U1.12 46.59,2.44 R38.2 46.48,2.28 R36.1
SHLD
  Top 0.406: R14.2 13,5 USB.SHLD1 10.15,5.45 USB.SHLD5 | USB.SHLD3 USB.SHLD5 | USB.SHLD5 USB.SHLD7 USB.SHLD8 USB.SHLD6 | USB.SHLD4 USB.SHLD6 | USB.SHLD2 10.15,10.55 USB.SHLD6
STATUS_LED1  (via drill 0.3 pad 0.61)
  Top 0.203: IC1.39 41.12,30.58 41.53,30.99 41.53,31.5 42.42,32.38 42.42,35.05 v42.29,35.18 | R22.1 20.45,48.25 20.7,48.01 21.59,48.01 22.99,46.61 22.99,43.94 23.37,43.56 29.34,43.56 30.23,44.45 32.13,44.45 32.64,43.94 40.77,43.94 v40.89,44.07
  Bottom 0.203: v40.89,44.07 41.27,43.69 41.27,36.2 v42.29,35.18
STATUS_LED2  (via drill 0.3 pad 0.61)
  Top 0.203: IC1.41 40.12,30.72 40.51,31.11 v40.51,31.75 | D3.C D4.A 19.43,50.8 19.18,50.55 19.18,48.13 19.81,47.5 21.34,47.5 22.48,46.35 22.48,43.69 22.99,43.18 29.59,43.18 30.48,44.07 31.88,44.07 32.38,43.56 39.5,43.56 v40.13,42.93
  Bottom 0.203: v40.51,31.75 41.02,32.26 41.02,34.42 40.26,35.18 40.26,39.88 39.37,40.77 39.37,42.16 v40.13,42.93
SWCLK  (via drill 0.3 pad 0.61)
  Top 0.203: IC1.45 38.12,30.46 37.47,31.11 37.47,33.15 v37.08,33.53 | v37.34,36.83 37.34,37.44 R33.2 36.98,38.23 SWD.SWCLK
  Bottom 0.203: v37.08,33.53 37.08,36.58 v37.34,36.83
SWDIO  (via drill 0.3 pad 0.61)
  Top 0.203: IC1.46 37.62,30.45 36.96,31.11 36.96,32.26 v36.45,32.77 | v33.91,38.48 33.91,38.86 34.54,39.5 SWD.SWDIO
  Bottom 0.203: v36.45,32.77 36.45,35.94 v33.91,38.48
UART_CS  (via drill 0.3 pad 0.61)
  Top 0.203: IC3.19 45.73,40.5 45.59,40.64 42.42,40.64 40.89,39.12 38.73,39.12 v37.72,40.13 | T3.1 27.87,44.39 R9.2 33.27,44.83 v33.53,44.58 33.78,44.32 35.69,44.32 35.95,44.59 T4.3
  Bottom 0.203: v37.72,40.13 37.72,40.39 v33.53,44.58
UART_PWR  (via drill 0.3 pad 0.61)
  Top 0.203: T4.5 39.25,45.34 R27.1 39.74,45.34 v40.51,45.34 | v32.89,24.07 33.08,24.07 33.27,24.26 34.8,24.26 34.96,24.42 IC1.11
  Bottom 0.203: v40.51,45.34 40.51,46.1 40.01,46.61 31.88,46.61 30.1,44.83 30.1,30.72 29.21,29.83 29.21,25.65 30.8,24.07 v32.89,24.07
UART_RX1
  Top 0.203: IC3.13 49.63,41.68 47.88,43.43 41.78,43.43 40.64,42.29 39.75,42.29 38.86,43.18 32.13,43.18 31.62,43.69 30.73,43.69 29.84,42.8 22.61,42.8 22.1,43.31 22.1,45.97 21.08,46.99 19.3,46.99 18.8,47.5 17.65,47.5 16.76,46.61 2.29,46.61 1.52,47.37 1.52,56.52 2.01,57 J7.4
UART_RX2  (via drill 0.3 pad 0.61)
  Top 0.203: IC3.17 47.03,41.11 45.85,42.29 42.55,42.29 40.51,40.26 39.5,40.26 38.1,41.66 27.43,41.66 26.04,40.26 19.3,40.26 18.03,41.53 v18.03,46.35 | v19.05,56.77 18.92,56.9 15,56.9 J8.4
  Bottom 0.203: v18.03,46.35 18.03,55.75 v19.05,56.77
UART_TX1  (via drill 0.3 pad 0.61)
  Top 0.203: J7.3 9.66,55 10.29,55.63 10.29,57.53 10.79,58.04 22.99,58.04 24.77,56.26 24.77,48.01 25.27,47.5 41.78,47.5 v42.67,46.61 | v42.29,37.47 42.29,36.96 42.55,36.7 49.4,36.7 50.28,35.83 IC3.9
  Bottom 0.203: v42.29,37.47 42.29,46.23 v42.67,46.61
UART_TX2  (via drill 0.3 pad 0.61)
  Top 0.203: J8.3 22.98,55 24.26,53.72 24.26,47.75 24.89,47.12 41.15,47.12 v41.66,46.61 | v44.07,35.94 47.12,35.94 47.68,35.38 IC3.5
  Bottom 0.203: v41.66,46.61 41.66,37.08 42.8,35.94 v44.07,35.94
UART_VCC
  Top 0.203: R32.2 6.22,47.37 5.84,47.75 5.84,49.4 5.33,49.91 2.67,49.91 2.41,50.16 2.41,52.7 2.71,53 J7.2
  Top 0.406: J8.2 18.33,53 19.3,53.98 22.61,53.98 23.5,53.09 23.5,45.59 23.75,45.34 T3.3
  Top 0.61: J7.2 J8.2
USB_D+
  Top 0.203: IC1.34 45.52,28.42 46.33,27.61 46.33,22.58 44.3,20.55 44.3,9.88 40.39,5.97 22.1,5.97 20.45,7.62 17.78,7.62 17.25,7.09 15.57,7.09 15.36,7.3 D1.2 14.17,7.3 13.46,8 USB.D+
USB_D-
  Top 0.203: IC1.33 45.41,27.92 45.92,27.41 45.92,22.81 43.89,20.78 43.89,10.11 40.11,6.33 22.38,6.33 20.73,7.98 17.78,7.98 17.45,8.31 15.54,8.31 15.33,8.1 D1.1 14.13,8.1 13.57,8.65 USB.D-
VBUS
  Top 0.203: F1.1 14.3,9.98
  Top 0.406: USB.VBUS 13.62,9.3 14.3,9.98
VCCANA
  Top 0.203: IC1.6 35.06,26.92 35.05,26.92 34.93,26.8 C16.2 C22.2 R23.2
VCCCORE
  Top 0.203: IC1.43 C21.2
XBEE1_CS
  Top 0.203: XBEE1.17 9,40.28 9.65,39.62 26.29,39.62 27.94,41.27 37.97,41.27 39.37,39.88 40.64,39.88 42.67,41.91 45.59,41.91 46.38,41.12 IC3.18
XBEE1_CTS/IRQ
  Top 0.203: XBEE1.12 19,42.09 19.81,41.27 R13.1
XBEE1_MISO  (via drill 0.3 pad 0.61)
  Top 0.203: XBEE1.4 9,25 9.78,25.78 23.69,25.78 24.77,24.7 24.77,21.72 23.5,20.45 23.5,17.4 v23.37,17.27 | v48.13,18.29 48.51,18.67 48.51,21.97 49.02,22.48 49.28,22.48 49.91,23.11 49.91,24.89 49.66,25.15 49.66,26.04 50.29,26.67 50.29,31.88 49.63,32.54 IC3.8 | v26.42,17.27 29.53,17.27 31.18,18.92 33.08,18.92 33.85,18.16 36.58,18.16 37.72,17.02 40.64,17.02 v41.02,16.64
  Bottom 0.203: v48.13,18.29 46.48,16.64 v41.02,16.64 | v26.42,17.27 v23.37,17.27
XBEE1_MOSI
  Top 0.2: 28.83,42.42 21.72,42.42 21.08,43.05 21.08,44.92 XBEE1.11
  Top 0.203: 28.83,42.42 38.61,42.42 39.5,41.53 40.89,41.53 42.04,42.67 46.1,42.67 47.68,41.09 IC3.16
XBEE1_RX
  Top 0.203: XBEE1.3 7,25.16 8,26.16 8.38,26.54 R12.2
XBEE1_SCK  (via drill 0.3 pad 0.61)
  Top 0.203: XBEE1.18 7,39.86 8,38.86 26.29,38.86 28.32,40.89 37.85,40.89 39.24,39.5 40.77,39.5 42.55,41.27 v45.21,41.27 | IC3.14 48.98,41.44 v48.9,41.53
  Bottom 0.203: v48.9,41.53 48.64,41.27 v45.21,41.27
XBEE1_TX
  Top 0.203: XBEE1.2 5,26.34 6.48,27.81 R11.2
XBEE1_VCC
  Top 0.2: R28.2 22.49,15.63 22.73,15.88 22.73,17.53 22.99,17.78 22.99,20.7 23.81,21.53 R10.1
  Top 0.406: C15.2 C14.2 14.8,20.38 14.22,20.95 3.04,20.95 C2.2 3.02,22.98 XBEE1.1 | C15.2 | C15.2 14.8,15.43 15.24,14.99 18.92,14.99 | 18.92,14.99 21.46,14.99 R28.2 | T7.3 18.92,15.76 18.92,14.99
XBEE2_CS  (via drill 0.3 pad 0.61)
  Top 0.203: IC5.3 v50.52,14.32 | v52.32,21.72 52.58,21.46 74.42,21.46 75,22.04 XBEE2.17
  Bottom 0.203: v50.52,14.32 51.18,14.99 51.18,20.83 52.07,21.72 v52.32,21.72
XBEE2_CTS/IRQ
  Top 0.203: XBEE2.12 65,23.39 64.01,24.38 R18.1
XBEE2_MISO  (via drill 0.3 pad 0.61)
  Top 0.203: XBEE2.4 75,42.62 74.3,41.91 61.98,41.91 61.09,41.02 61.09,29.21 60.45,28.57 57.53,28.57 v57.4,28.45 | IC5.11 56.26,9.78 v56.52,10.03
  Bottom 0.203: v57.4,28.45 57.4,17.91 56.52,17.02 v56.52,10.03
XBEE2_MOSI  (via drill 0.3 pad 0.61)
  Top 0.203: v53.34,22.23 62.23,22.23 XBEE2.11 | IC5.7 52.28,11.72 v52.32,11.68
  Bottom 0.203: v52.32,11.68 52.32,19.94 53.34,20.95 v53.34,22.23
XBEE2_RX
  Top 0.203: R20.2 60.83,27.81 61.72,28.7 61.72,40.51 62.61,41.4 75.82,41.4 77,42.58 XBEE2.3
XBEE2_SCK  (via drill 0.3 pad 0.61)
  Top 0.203: IC5.5 51.63,13.03 v51.69,13.08 | v52.07,20.7 52.32,20.95 75.95,20.95 77,22.01 XBEE2.18
  Bottom 0.203: v51.69,13.08 51.69,20.32 v52.07,20.7
XBEE2_TX
  Top 0.203: R21.2 60.83,26.67 62.36,28.19 62.36,40.13 63.12,40.89 77.34,40.89 79,42.55 XBEE2.2
XBEE2_VCC  (via drill 0.3, 0.3 pad 0.61)
  Top 0.406: 82.29,49.03 81.84,49.03 C18.2
  Top 0.61: XBEE2.1 81.58,45 82.29,45.71 C17.2 82.29,49.03 | v59.82,40.64 59.05,40.64 | 59.05,40.64 R29.2 T6.3 | 59.05,40.64 R19.1 | C18.2 C19.2 v81.72,54.17
  Bottom 0.61: v81.72,54.17 v81.72,53.53 81.72,53.78 81.66,53.85 64.9,53.85 59.82,48.77 v59.82,40.64

### Text on the board
tPlace: UART | I2C/Wire | Reset | USB | microSD | senseBox | Open | Rev 1.0 | Hardware
Reference: Silkscreen: 21 tPlace